# EAGLE design megajoltC (EAGLE 5.09)

## Sheet 1 of 5
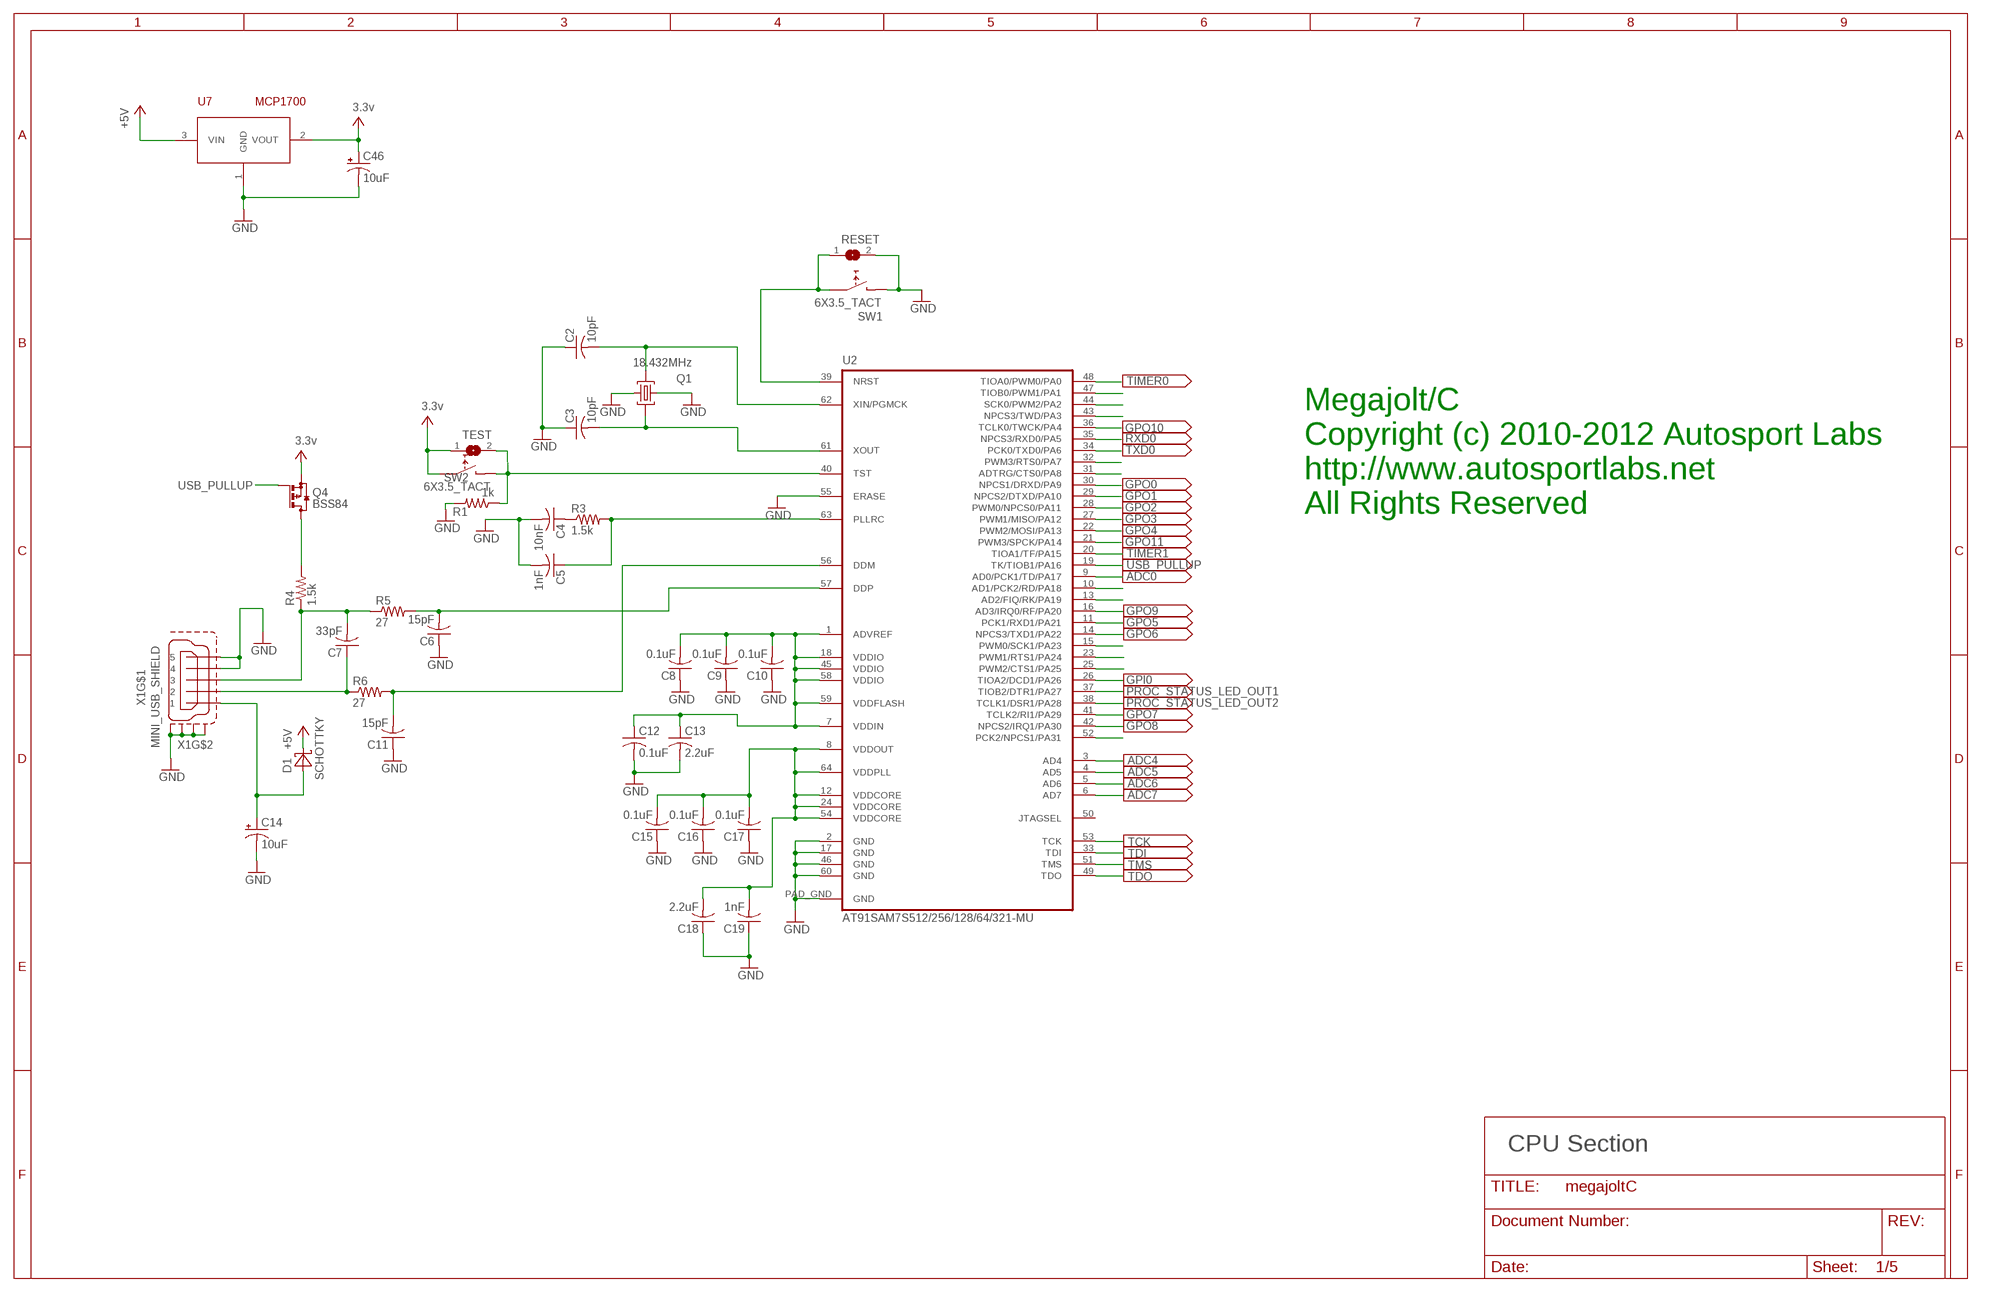
[diagram p0: schematic, sheet 1]

### Parts
C2  10pF  C-USC0603  [C0603]
C3  10pF  C-USC0603  [C0603]
C4  10nF  C-USC0603  [C0603]
C5  1nF  C-USC0603  [C0603]
C6  15pF  C-USC0603  [C0603]
C7  33pF  C-USC0603  [C0603]
C8  0.1uF  C-USC0603  [C0603]
C9  0.1uF  C-USC0603  [C0603]
C10  0.1uF  C-USC0603  [C0603]
C11  15pF  C-USC0603  [C0603]
C12  0.1uF  C-USC0603  [C0603]
C13  2.2uF  C-USC0603  [C0603]
C14  10uF  CPOL-USSMCA  [SMC_A]
C15  0.1uF  C-USC0603  [C0603]
C16  0.1uF  C-USC0603  [C0603]
C17  0.1uF  C-USC0603  [C0603]
C18  2.2uF  C-USC0603  [C0603]
C19  1nF  C-USC0603  [C0603]
C46  10uF  CPOL-USSMCA  [SMC_A]
D1  SCHOTTKY  [SMA]
Q1  18.432MHz  ABM8X2  [5X3.2]
Q4  BSS84  [SOT23]
R1  1k  R-US_R0603  [R0603]
R3  1.5k  R-US_R0603  [R0603]
R4  1.5k  R-US_R0603  [R0603]
R5  27  R-US_R0603  [R0603]
R6  27  R-US_R0603  [R0603]
RESET  SJ  [SJ]
SW1  6X3.5_TACT  [TACT_6X3.5]
SW2  6X3.5_TACT  [TACT_6X3.5]
TEST  SJ  [SJ]
U2  AT91SAM7S512/256/128/64/321-MU  [QFN64]
U7  MCP1700  [SOT-23]
X1  MINI_USB_SHIELD  [MINI-USB_JACK]

### Nets
+5V: D1.C U7.3(VIN) ; also sheet 2,3,4,5
ADC0: U2.9(AD0/PCK1/TD/PA17) ; also sheet 2
ADC4: U2.3(AD4) ; also sheet 2
ADC5: U2.4(AD5) ; also sheet 2
ADC6: U2.5(AD6) ; also sheet 2
ADC7: U2.6(AD7) ; also sheet 2
DDM: C11.2 R6.2 U2.56(DDM)
DDP: C6.2 R5.2 U2.57(DDP)
GND: C2.1 C3.1 C4.2 C5.2 C6.1 C8.1 C9.1 C10.1 C11.1 C12.2 C13.2 C14.- C15.1 C16.1 C17.1 C18.1 C19.1 C46.- Q1.2(CRYSTAL1) Q1.4(CRYSTAL2) R1.2 RESET.2 SW1.P$2 U2.2(GND) U2.17(GND) U2.46(GND) U2.55(ERASE) U2.60(GND) U2.PAD_GND(GND) U7.1(GND) X1.4 X1.5 X1.M1(S1) X1.M2(S2) X1.M3(S3) X1.M4(S4) ; also sheet 2,3,4,5
GPI0: U2.26(TIOA2/DCD1/PA26) ; also sheet 2
GPO0: U2.30(NPCS1/DRXD/PA9) ; also sheet 5
GPO1: U2.29(NPCS2/DTXD/PA10) ; also sheet 5
GPO2: U2.28(PWM0/NPCS0/PA11) ; also sheet 5
GPO3: U2.27(PWM1/MISO/PA12) ; also sheet 5
GPO4: U2.22(PWM2/MOSI/PA13) ; also sheet 5
GPO5: U2.11(PCK1/RXD1/PA21) ; also sheet 5
GPO6: U2.14(NPCS3/TXD1/PA22) ; also sheet 5
GPO7: U2.41(TCLK2/RI1/PA29) ; also sheet 5
GPO8: U2.42(NPCS2/IRQ1/PA30) ; also sheet 2
GPO9: U2.16(AD3/IRQ0/RF/PA20) ; also sheet 2
GPO10: U2.36(TCLK0/TWCK/PA4) ; also sheet 5
GPO11: U2.21(PWM3/SPCK/PA14) ; also sheet 2
N$1: R1.1 SW2.P$2 TEST.2 U2.40(TST)
N$3: C7.2 R4.1 R5.1 X1.3
N$4: C7.1 R6.1 X1.2
N$17: U2.47(TIOB0/PWM1/PA1)
N$18: Q4.3(D) R4.2
N$20: U2.44(SCK0/PWM2/PA2)
N$23: U2.43(NPCS3/TWD/PA3)
N$24: U2.32(PWM3/RTS0/PA7)
N$25: U2.31(ADTRG/CTS0/PA8)
N$34: U2.23(PWM1/RTS1/PA24)
N$35: U2.10(AD1/PCK2/RD/PA18)
N$36: U2.13(AD2/FIQ/RK/PA19)
N$37: U2.15(PWM0/SCK1/PA23)
N$38: U2.25(PWM2/CTS1/PA25)
N$39: U2.52(PCK2/NPCS1/PA31)
N$40: C4.1 R3.1
PLLRC: C5.1 R3.2 U2.63(PLLRC)
PROC_STATUS_LED_OUT1: U2.37(TIOB2/DTR1/PA27) ; also sheet 2
PROC_STATUS_LED_OUT2: U2.38(TCLK1/DSR1/PA28) ; also sheet 2
RESET: RESET.1 SW1.P$1 U2.39(NRST) ; also sheet 3
RXD0: U2.35(NPCS3/RXD0/PA5) ; also sheet 3
TCK: U2.53(TCK) ; also sheet 3
TDI: U2.33(TDI) ; also sheet 3
TDO: U2.49(TDO) ; also sheet 3
TIMER0: U2.48(TIOA0/PWM0/PA0) ; also sheet 4
TIMER1: U2.20(TIOA1/TF/PA15) ; also sheet 4
TMS: U2.51(TMS) ; also sheet 3
TXD0: U2.34(PCK0/TXD0/PA6) ; also sheet 3
USB_PULLUP: Q4.1(G) U2.19(TK/TIOB1/PA16)
V+: C8.2 C9.2 C10.2 C12.1 C13.1 C46.+ Q4.2(S) SW2.P$1 TEST.1 U2.1(ADVREF) U2.7(VDDIN) U2.18(VDDIO) U2.45(VDDIO) U2.58(VDDIO) U2.59(VDDFLASH) U7.2(VOUT) ; supply symbol labelled 3.3v ; also sheet 3
VBUS: C14.+ D1.A X1.1
VDDOUT: C15.2 C16.2 C17.2 C18.2 C19.2 U2.8(VDDOUT) U2.12(VDDCORE) U2.24(VDDCORE) U2.54(VDDCORE) U2.64(VDDPLL)
XIN1: C3.2 Q1.1(GND1) U2.61(XOUT)
XOUT1: C2.2 Q1.3(GND2) U2.62(XIN/PGMCK)
Unconnected: U2.50(JTAGSEL)

### Notes on the sheet
- Megajolt/C
- Copyright (c) 2010-2012 Autosport Labs
- http://www.autosportlabs.net
- All Rights Reserved
- CPU Section

## Sheet 2 of 5
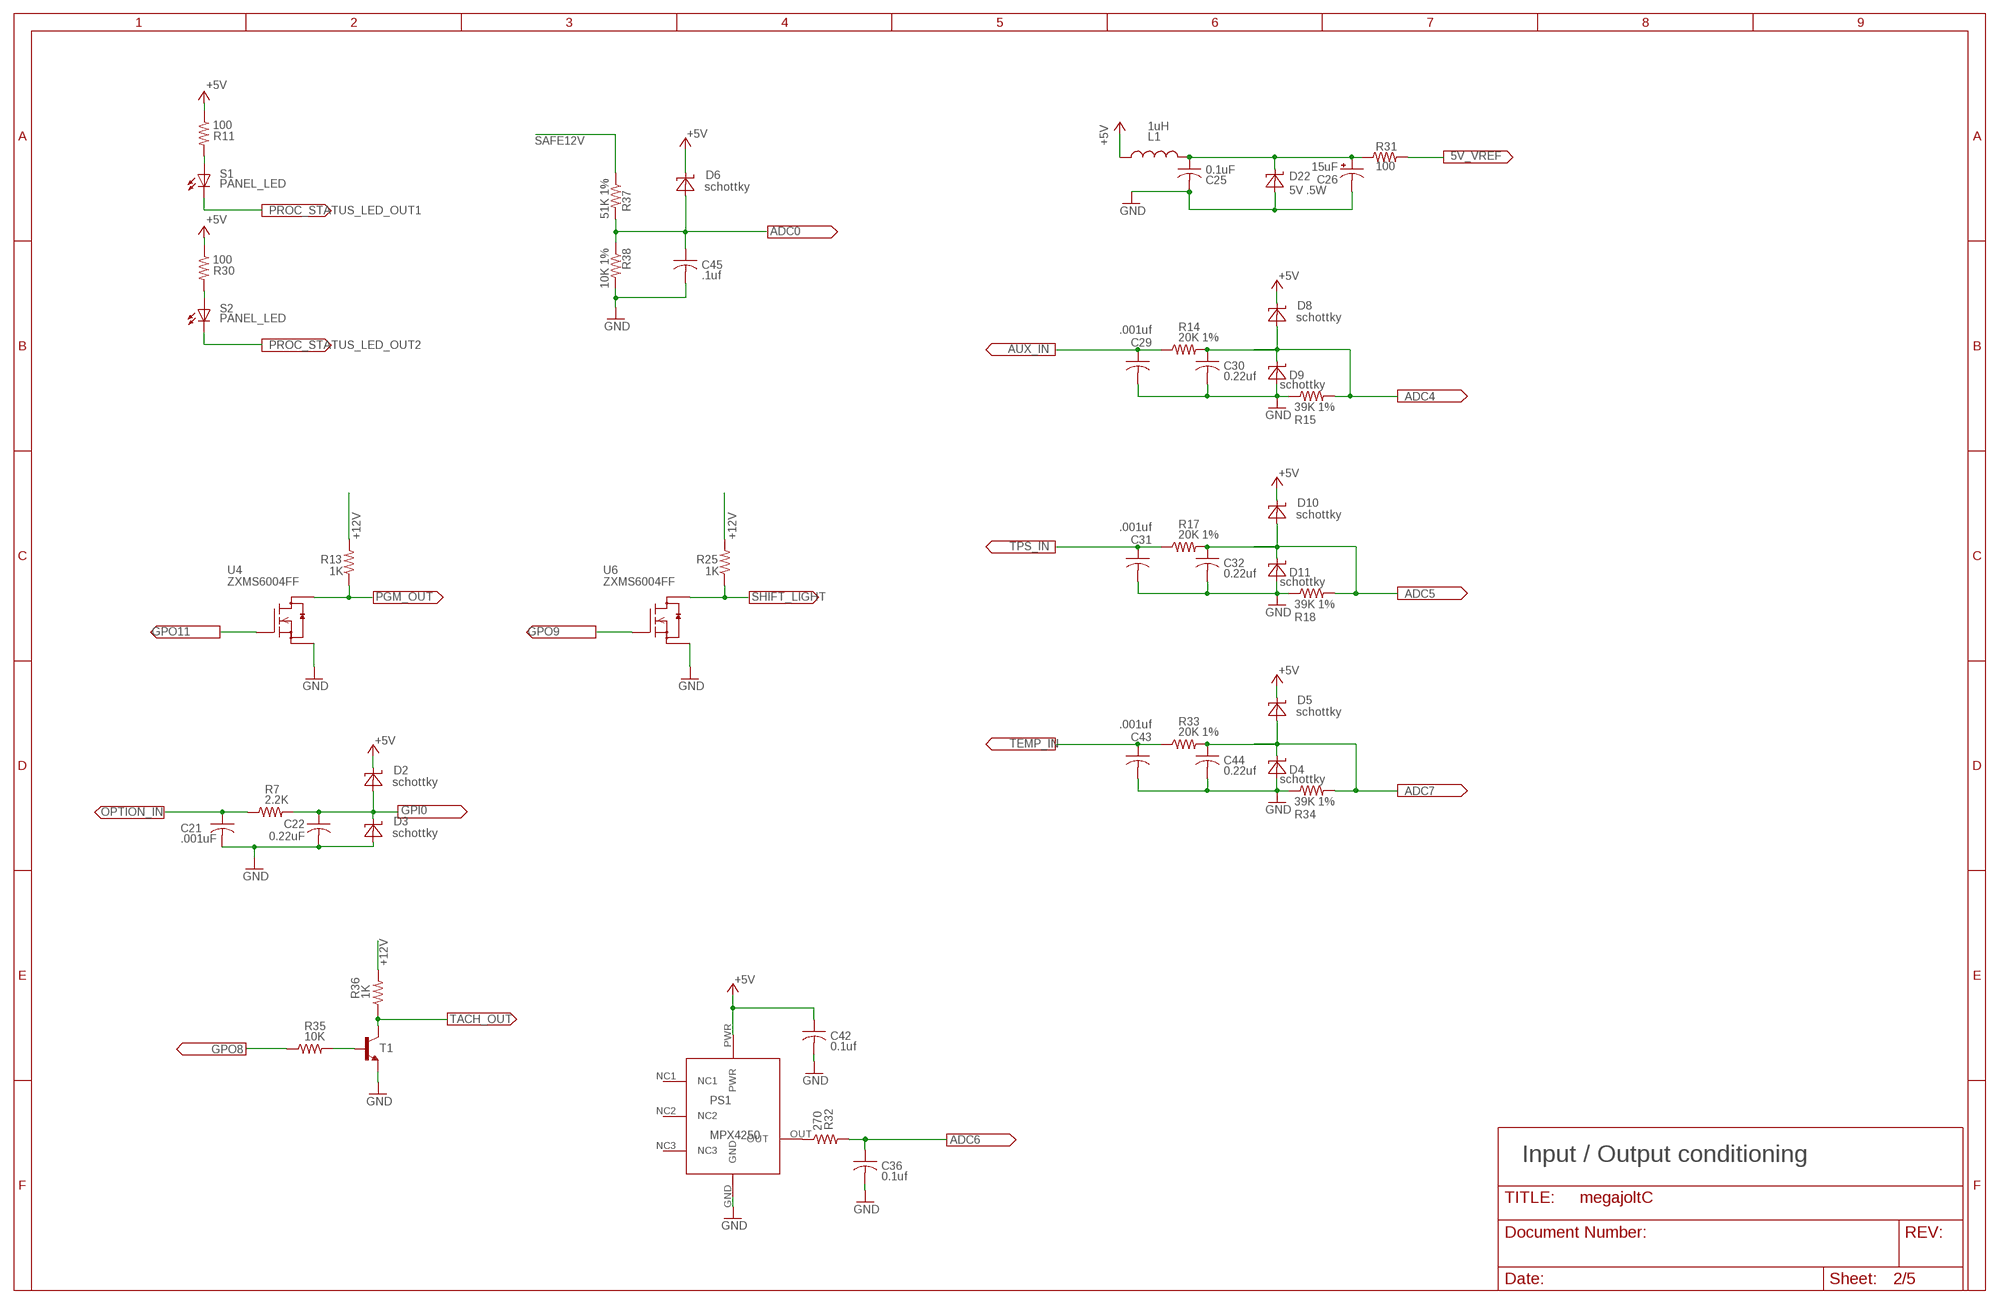
[diagram p1: schematic, sheet 2]

### Parts
C21  .001uF  C-USC0603  [C0603]
C22  0.22uF  C-USC0603  [C0603]
C25  0.1uF  C-USC0603  [C0603]
C26  15uF  CPOL-USSMCA  [SMC_A]
C29  .001uf  C-USC0603  [C0603]
C30  0.22uf  C-USC0603  [C0603]
C31  .001uf  C-USC0603  [C0603]
C32  0.22uf  C-USC0603  [C0603]
C36  0.1uf  C-USC0603  [C0603]
C42  0.1uf  C-USC0603  [C0603]
C43  .001uf  C-USC0603  [C0603]
C44  0.22uf  C-USC0603  [C0603]
C45  .1uf  C-USC0603  [C0603]
D2  schottky  ZENER2  [SOD123]
D3  schottky  ZENER2  [SOD123]
D4  schottky  ZENER2  [SOD123]
D5  schottky  ZENER2  [SOD123]
D6  schottky  ZENER2  [SOD123]
D8  schottky  ZENER2  [SOD123]
D9  schottky  ZENER2  [SOD123]
D10  schottky  ZENER2  [SOD123]
D11  schottky  ZENER2  [SOD123]
D22  5V .5W  ZENER2  [SOD123]
L1  1uH  INDUCTOR  [1210]
PS1  MPX4250  [MPX4250]
R7  2.2K  R-US_R0603  [R0603]
R11  100  R-US_R0603  [R0603]
R13  1K  R-US_R0603  [R0603]
R14  20K 1%  R-US_R0603  [R0603]
R15  39K 1%  R-US_R0603  [R0603]
R17  20K 1%  R-US_R0603  [R0603]
R18  39K 1%  R-US_R0603  [R0603]
R25  1K  R-US_R0603  [R0603]
R30  100  R-US_R0603  [R0603]
R31  100  R-US_R1206  [R1206]
R32  270  R-US_R0603  [R0603]
R33  20K 1%  R-US_R0603  [R0603]
R34  39K 1%  R-US_R0603  [R0603]
R35  10K  R-US_R0603  [R0603]
R36  1K  R-US_R0603  [R0603]
R37  51K 1%  R-US_R0603  [R0603]
R38  10K 1%  R-US_R0603  [R0603]
S1  PANEL_LED  [RIGHTANGLE_CML_5323F5]
S2  PANEL_LED  [RIGHTANGLE_CML_5323F5]
T1  -NPN-SOT23-EBC  [SOT23-EBC]
U4  ZXMS6004FF  [SOT-23]
U6  ZXMS6004FF  [SOT-23]

### Nets
5V_VREF: R31.2 ; also sheet 3
5V_VREF_PROTECTED: C25.1 C26.+ D22.C L1.2 R31.1
+5V: C42.1 D2.C D5.C D6.C D8.C D10.C L1.1 PS1.PWR R11.1 R30.1 ; also sheet 1,3,4,5
+12V: R13.2 R25.2 R36.2 ; also sheet 3
ADC0: C45.1 D6.A R37.2 R38.1 ; also sheet 1
ADC4: C30.1 D8.A D9.C R14.2 R15.2 ; also sheet 1
ADC5: C32.1 D10.A D11.C R17.2 R18.2 ; also sheet 1
ADC6: C36.1 R32.2 ; also sheet 1
ADC7: C44.1 D4.C D5.A R33.2 R34.2 ; also sheet 1
AUX_IN: C29.1 R14.1 ; also sheet 3
GND: C21.2 C22.2 C25.2 C26.- C29.2 C30.2 C31.2 C32.2 C36.2 C42.2 C43.2 C44.2 C45.2 D3.A D4.A D9.A D11.A D22.A PS1.GND R15.1 R18.1 R34.1 R38.2 T1.E U4.2(S1) U6.2(S1) ; also sheet 1,3,4,5
GPI0: D2.A D3.C ; also sheet 1
GPO8: R35.1 ; also sheet 1
GPO9: U6.1(G) ; also sheet 1
GPO11: U4.1(G) ; also sheet 1
N$7: PS1.OUT R32.1
N$16: R35.2 T1.B
N$19: R11.2 S1.A
N$21: R30.2 S2.A
OPTION_IN: C21.1 R7.1 ; also sheet 3
PGM_OUT: R13.1 U4.3(D1) ; also sheet 3
PROC_PULSE_IN: C22.1 R7.2
PROC_STATUS_LED_OUT1: S1.C ; also sheet 1
PROC_STATUS_LED_OUT2: S2.C ; also sheet 1
SAFE12V: R37.1 ; also sheet 3
SHIFT_LIGHT: R25.1 U6.3(D1) ; also sheet 3
TACH_OUT: R36.1 T1.C ; also sheet 3
TEMP_IN: C43.1 R33.1 ; also sheet 3
TPS_IN: C31.1 R17.1 ; also sheet 3

### Notes on the sheet
- Input / Output conditioning

## Sheet 3 of 5
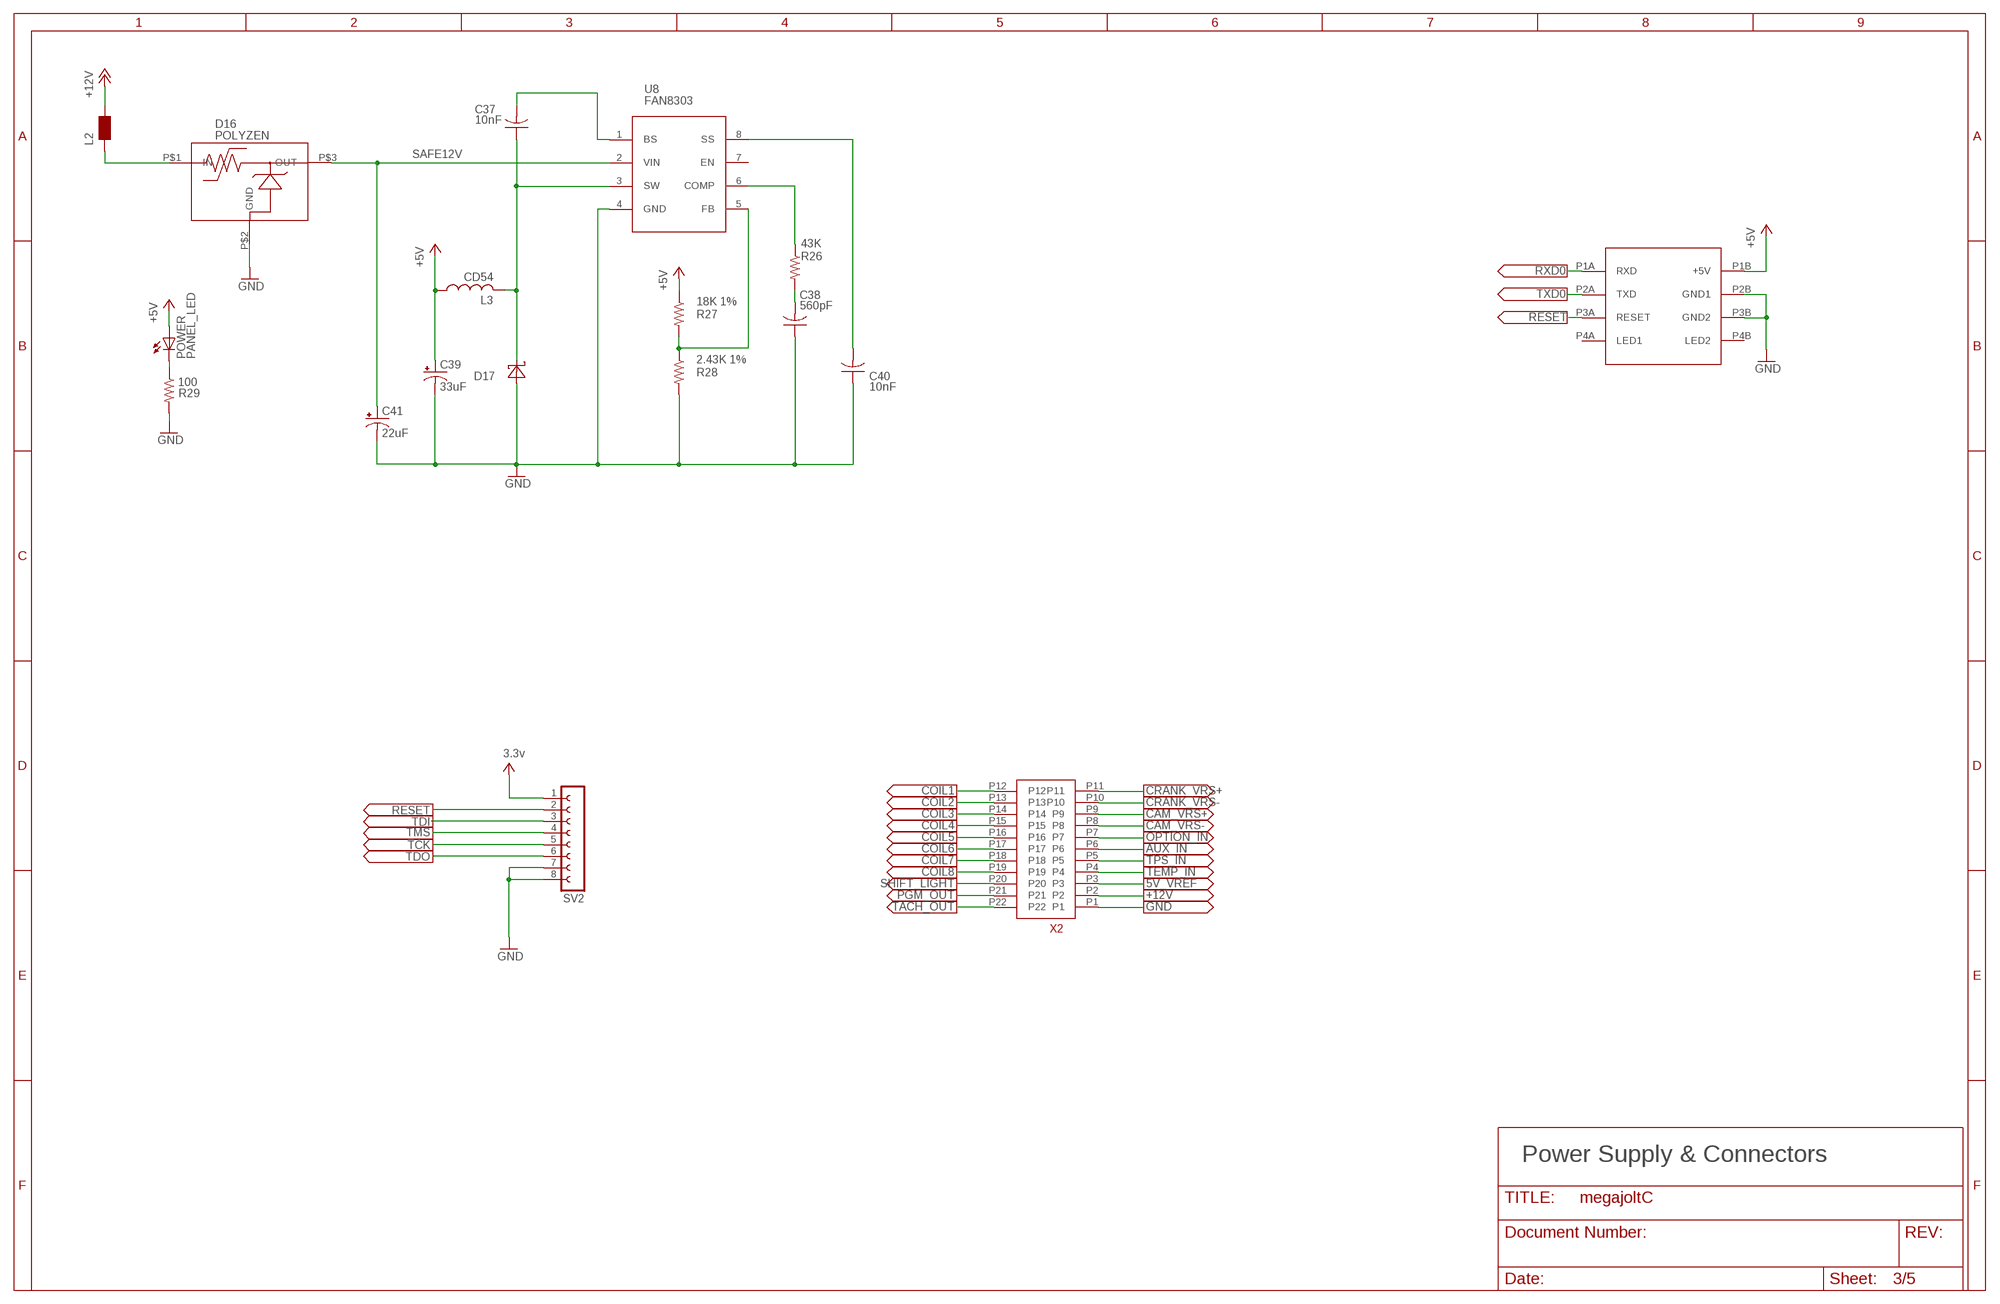
[diagram p2: schematic, sheet 3]

### Parts
BLUE_TUNE  ASL_BLUETOOTH_MODULE  [BLUETOOTH_MODULE]
C37  10nF  C-USC0603  [C0603]
C38  560pF  C-USC0603  [C0603]
C39  33uF  CPOL-USSMCD  [SMC_D]
C40  10nF  C-USC0603  [C0603]
C41  22uF  CPOL-US153CLV-0605  [153CLV-0605]
D16  POLYZEN  [POLYZEN]
D17  SCHOTTKY  [SMA]
L2  WE-CBF_1812  [1812]
L3  CD54  [CD54]
POWER  PANEL_LED  [RIGHTANGLE_CML_5323F5]
R26  43K  R-US_R0603  [R0603]
R27  18K 1%  R-US_R0603  [R0603]
R28  2.43K 1%  R-US_R0603  [R0603]
R29  100  R-US_R0603  [R0603]
SV2  FE08-1  [FE08]
U8  FAN8303  [SO-8]
X2  MOLEX_MINIFIT-22  [MOLEX_MINIFIT-22]

### Nets
5V_VREF: X2.P3 ; also sheet 2
+5V: BLUE_TUNE.P1B(+5V) C39.+ L3.P$1 POWER.A R27.1 ; also sheet 1,2,4,5
+12V: L2.2 X2.P2 ; also sheet 2
AUX_IN: X2.P6 ; also sheet 2
CAM_VRS+: X2.P9 ; also sheet 4
CAM_VRS-: X2.P8 ; also sheet 4
COIL1: X2.P12 ; also sheet 5
COIL2: X2.P13 ; also sheet 5
COIL3: X2.P14 ; also sheet 5
COIL4: X2.P15 ; also sheet 5
COIL5: X2.P16 ; also sheet 5
COIL6: X2.P17 ; also sheet 5
COIL7: X2.P18 ; also sheet 5
COIL8: X2.P19 ; also sheet 5
CRANK_VRS+: X2.P11 ; also sheet 4
CRANK_VRS-: X2.P10 ; also sheet 4
GND: BLUE_TUNE.P2B(GND1) BLUE_TUNE.P3B(GND2) C38.1 C39.- C40.1 C41.- D16.P$2(GND) D17.A R28.2 R29.2 SV2.7 SV2.8 U8.4(GND) X2.P1 ; also sheet 1,2,4,5
N$8: R27.2 R28.1 U8.5(FB)
N$9: C37.2 U8.1(BS)
N$10: C37.1 D17.C L3.P$2 U8.3(SW)
N$11: C38.2 R26.2
N$12: R26.1 U8.6(COMP)
N$13: C40.2 U8.8(SS)
N$15: D16.P$1(IN) L2.1
N$22: POWER.C R29.1
OPTION_IN: X2.P7 ; also sheet 2
PGM_OUT: X2.P21 ; also sheet 2
RESET: BLUE_TUNE.P3A(RESET) SV2.2 ; also sheet 1
RXD0: BLUE_TUNE.P1A(RXD) ; also sheet 1
SAFE12V: C41.+ D16.P$3(OUT) U8.2(VIN) ; also sheet 2
SHIFT_LIGHT: X2.P20 ; also sheet 2
TACH_OUT: X2.P22 ; also sheet 2
TCK: SV2.5 ; also sheet 1
TDI: SV2.3 ; also sheet 1
TDO: SV2.6 ; also sheet 1
TEMP_IN: X2.P4 ; also sheet 2
TMS: SV2.4 ; also sheet 1
TPS_IN: X2.P5 ; also sheet 2
TXD0: BLUE_TUNE.P2A(TXD) ; also sheet 1
V+: SV2.1 ; supply symbol labelled 3.3v ; also sheet 1
Unconnected: BLUE_TUNE.P4A(LED1) BLUE_TUNE.P4B(LED2) U8.7(EN)

### Notes on the sheet
- Power Supply & Connectors

## Sheet 4 of 5
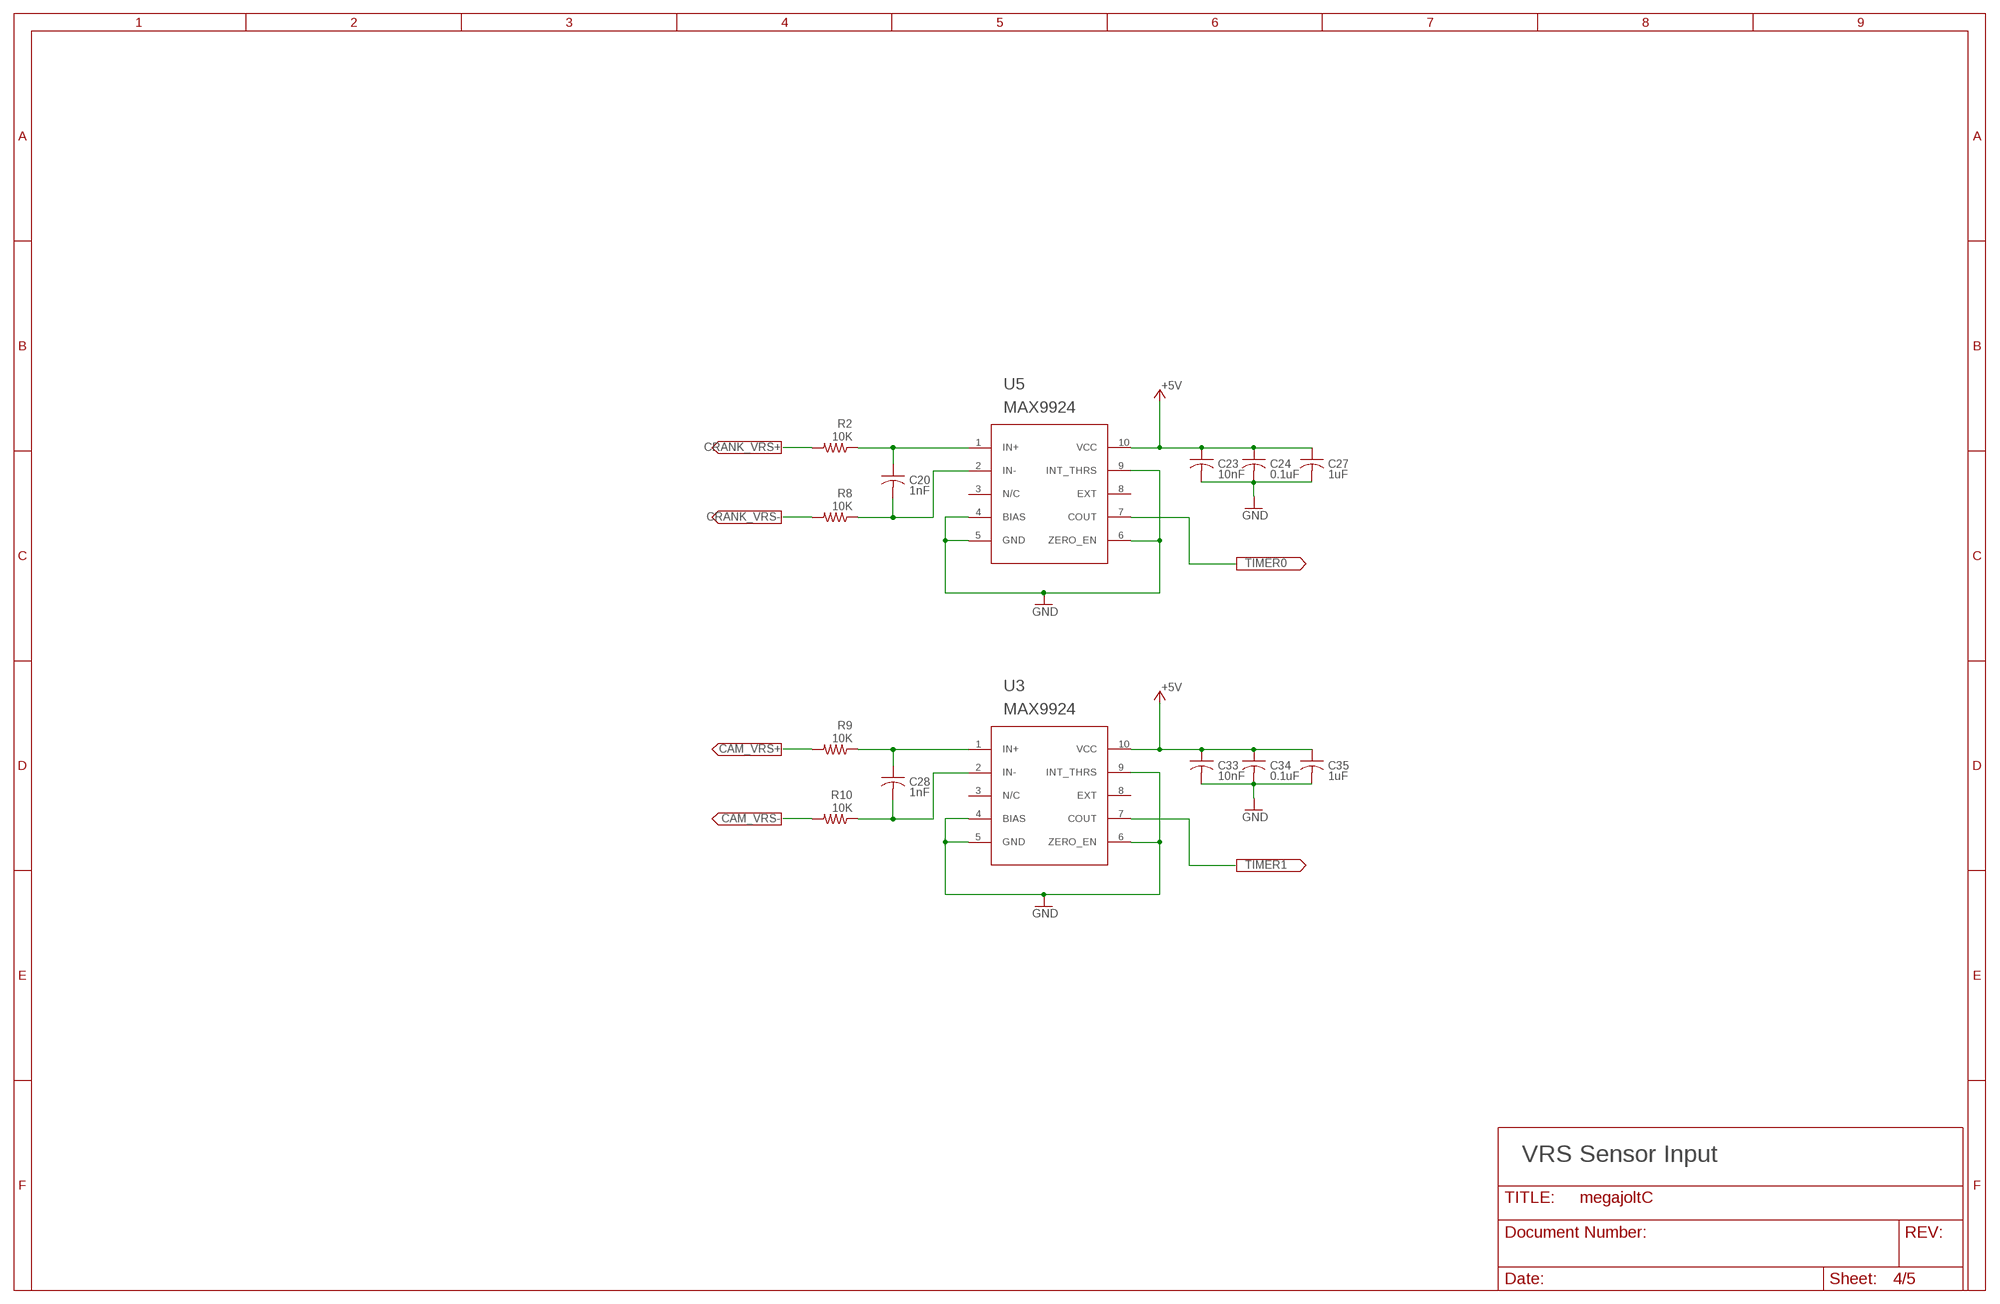
[diagram p3: schematic, sheet 4]

### Parts
C20  1nF  C-USC0603  [C0603]
C23  10nF  C-USC0603  [C0603]
C24  0.1uF  C-USC0603  [C0603]
C27  1uF  C-USC0603  [C0603]
C28  1nF  C-USC0603  [C0603]
C33  10nF  C-USC0603  [C0603]
C34  0.1uF  C-USC0603  [C0603]
C35  1uF  C-USC0603  [C0603]
R2  10K  R-US_R0603  [R0603]
R8  10K  R-US_R0603  [R0603]
R9  10K  R-US_R0603  [R0603]
R10  10K  R-US_R0603  [R0603]
U3  MAX9924  [UMAX10]
U5  MAX9924  [UMAX10]

### Nets
+5V: C23.1 C24.1 C27.1 C33.1 C34.1 C35.1 U3.10(VCC) U5.10(VCC) ; also sheet 1,2,3,5
CAM_VRS+: R9.2 ; also sheet 3
CAM_VRS-: R10.2 ; also sheet 3
CRANK_VRS+: R2.2 ; also sheet 3
CRANK_VRS-: R8.2 ; also sheet 3
GND: C23.2 C24.2 C27.2 C33.2 C34.2 C35.2 U3.4(BIAS) U3.5(GND) U3.6(ZERO_EN) U3.9(INT_THRS) U5.4(BIAS) U5.5(GND) U5.6(ZERO_EN) U5.9(INT_THRS) ; also sheet 1,2,3,5
N$2: C20.1 R2.1 U5.1(IN+)
N$5: C28.1 R9.1 U3.1(IN+)
N$6: C28.2 R10.1 U3.2(IN-)
N$14: C20.2 R8.1 U5.2(IN-)
TIMER0: U5.7(COUT) ; also sheet 1
TIMER1: U3.7(COUT) ; also sheet 1
Unconnected: U3.3(N/C) U3.8(EXT) U5.3(N/C) U5.8(EXT)

### Notes on the sheet
- VRS Sensor Input

## Sheet 5 of 5
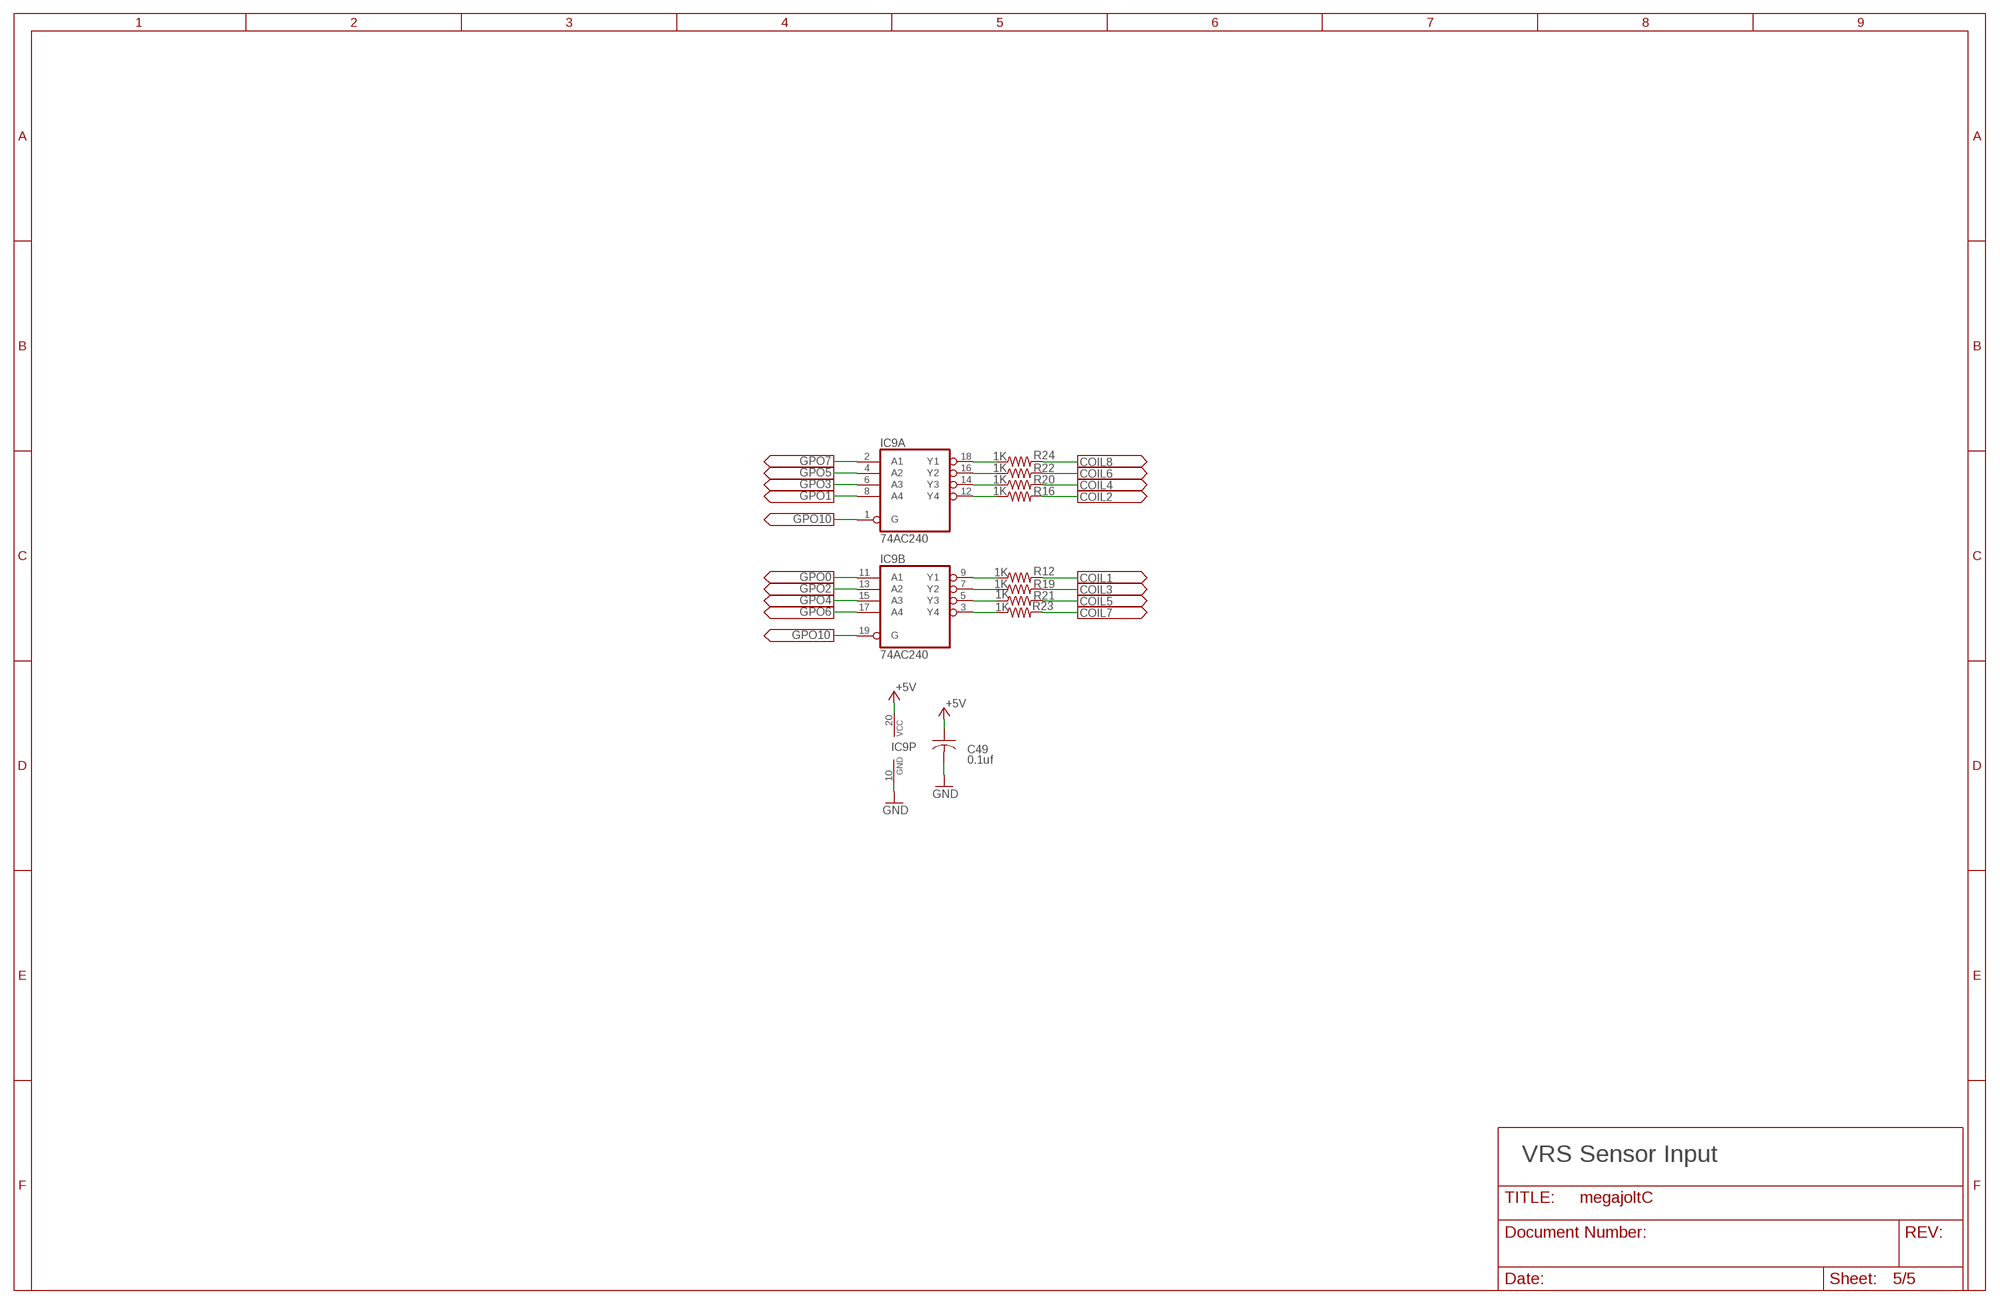
[diagram p4: schematic, sheet 5]

### Parts
C49  0.1uf  C-USC0603  [C0603]
IC9  74AC240  74S240DW  [SO20W]
R12  1K  R-US_R0603  [R0603]
R16  1K  R-US_R0603  [R0603]
R19  1K  R-US_R0603  [R0603]
R20  1K  R-US_R0603  [R0603]
R21  1K  R-US_R0603  [R0603]
R22  1K  R-US_R0603  [R0603]
R23  1K  R-US_R0603  [R0603]
R24  1K  R-US_R0603  [R0603]

### Nets
+5V: C49.1 IC9.20(P:VCC) ; also sheet 1,2,3,4
COIL1: R12.2 ; also sheet 3
COIL2: R16.2 ; also sheet 3
COIL3: R19.2 ; also sheet 3
COIL4: R20.2 ; also sheet 3
COIL5: R21.2 ; also sheet 3
COIL6: R22.2 ; also sheet 3
COIL7: R23.2 ; also sheet 3
COIL8: R24.2 ; also sheet 3
GND: C49.2 IC9.10(P:GND) ; also sheet 1,2,3,4
GPO0: IC9.11(B:A1) ; also sheet 1
GPO1: IC9.8(A:A4) ; also sheet 1
GPO2: IC9.13(B:A2) ; also sheet 1
GPO3: IC9.6(A:A3) ; also sheet 1
GPO4: IC9.15(B:A3) ; also sheet 1
GPO5: IC9.4(A:A2) ; also sheet 1
GPO6: IC9.17(B:A4) ; also sheet 1
GPO7: IC9.2(A:A1) ; also sheet 1
GPO10: IC9.1(A:G) IC9.19(B:G) ; also sheet 1
N$26: IC9.9(B:Y1) R12.1
N$27: IC9.12(A:Y4) R16.1
N$28: IC9.7(B:Y2) R19.1
N$29: IC9.14(A:Y3) R20.1
N$30: IC9.5(B:Y3) R21.1
N$31: IC9.16(A:Y2) R22.1
N$32: IC9.3(B:Y4) R23.1
N$33: IC9.18(A:Y1) R24.1

### Notes on the sheet
- VRS Sensor Input

## Power pins joined to a net without a drawn wire
NC1: PS1.NC1
NC2: PS1.NC2
NC3: PS1.NC3

## Library data of the parts
BLUE_TUNE = asl_bluetooth_module:ASL_BLUETOOTH_MODULE
C2-C13 C15-C25 C27-C38 C40 C42-C45 C49 = rcl:C-US: CAPACITOR, American symbol
C14 C26 C39 C41 C46 = rcl:CPOL-US: POLARIZED CAPACITOR, American symbol
D1 D17 = smt_diodes:SCHOTTKY
D2-D6 D8-D11 D22 = smt_diodes:ZENER
D16 = polyzen:POLYZEN
IC9 = 74xx-eu:74*240: Octal BUFFER and LINE DRIVER, 3-state
L1 = smt_inductors:INDUCTOR
L2 = wuerth-elektronik:WE-CBF: SMD EMI Suppression Ferrite Beads - excellent anti-EMI properties - low DCR - impedances till 3000 ohms - rated current up to 6 A
L3 = sumida_inductors:CD54
POWER S1 S2 = LEDs:PANEL_LED
PS1 = pressure_sensor:MPX4250
Q1 = crystal_smd:ABM8X
Q4 = transistor-small-signal:BSS84: P-CHANNEL MOS FET
R1-R38 = rcl:R-US_: RESISTOR, American symbol
RESET TEST = jumper:SJ: SMD solder JUMPER
SV2 = con-lsta:FE08-1: FEMALE HEADER; OC_FARNELL: unknown; OC_NEWARK: unknown
SW1 SW2 = tactile_switch:6X3.5_TACT
T1 = transistor:*-NPN-: NPN Transistror BF959 corrected 2008.03.06
U2 = atmel-arm:AT91SAM7S512/256/128/64/321: AT91SAM7S512/256/128/64/321 ARM7 Processor
U3 U5 = max9924_9927:MAX9924
U4 U6 = power_mosfets:ZXMS6004FF
U7 = mcp1700:MCP1700
U8 = voltage_regulators:FAN8303
X1 = cnkls_parts:MINI_USB_SHIELD
X2 = molex_mini-fit:MOLEX_MINIFIT-22

## Board
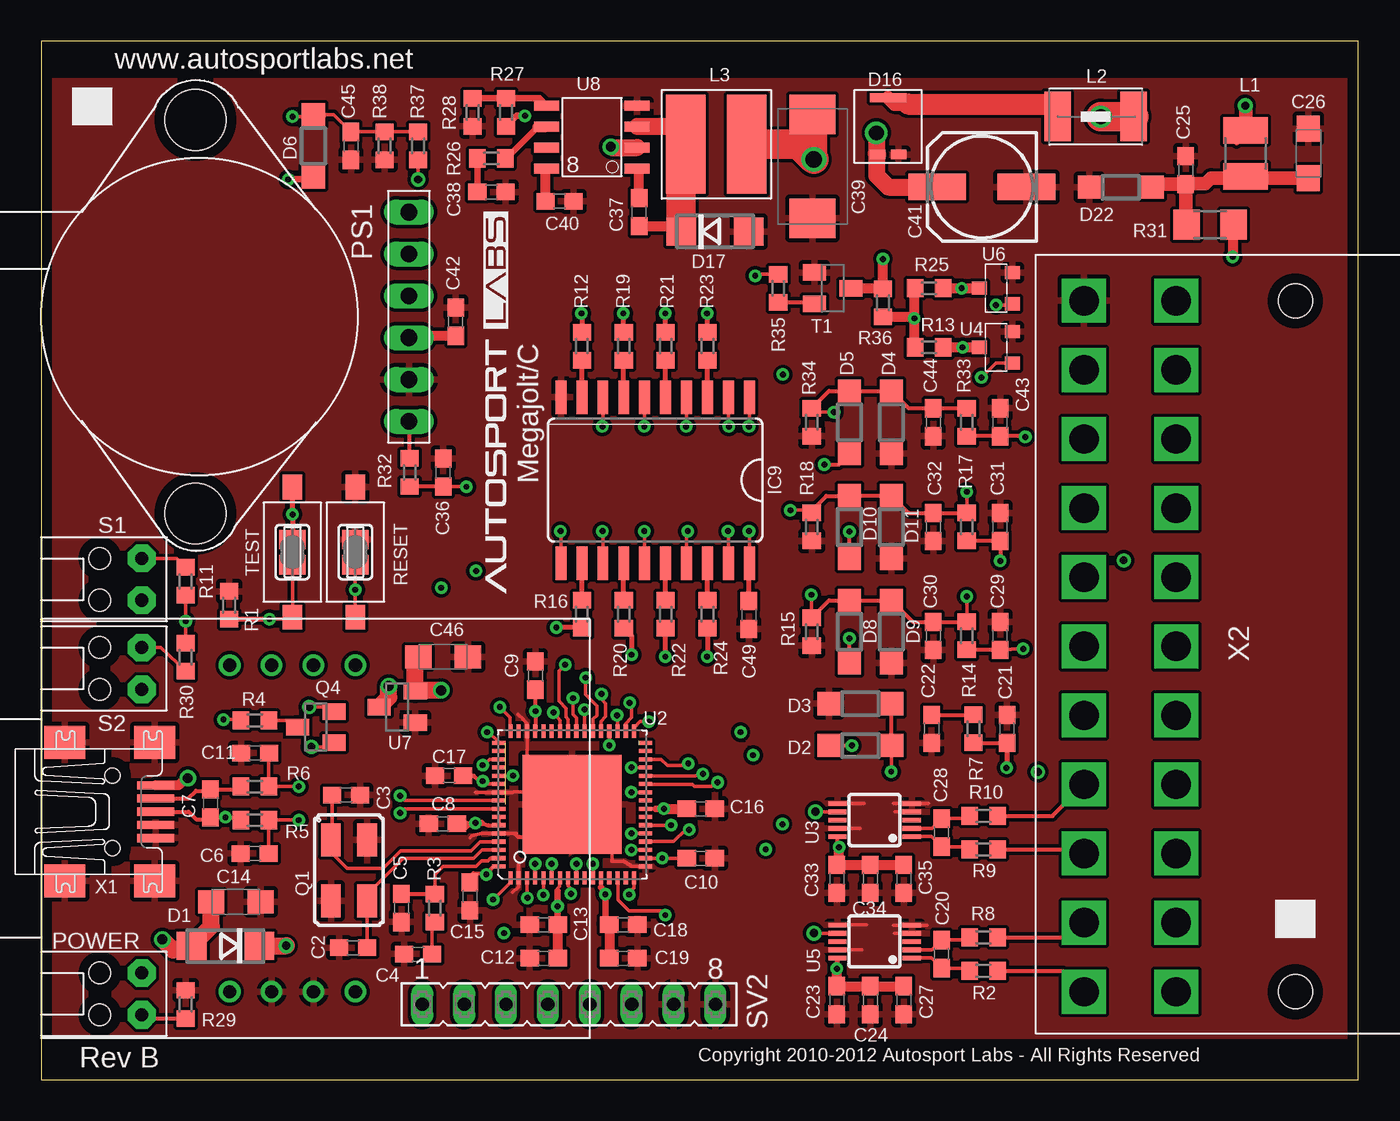
[diagram p5: board, top side]
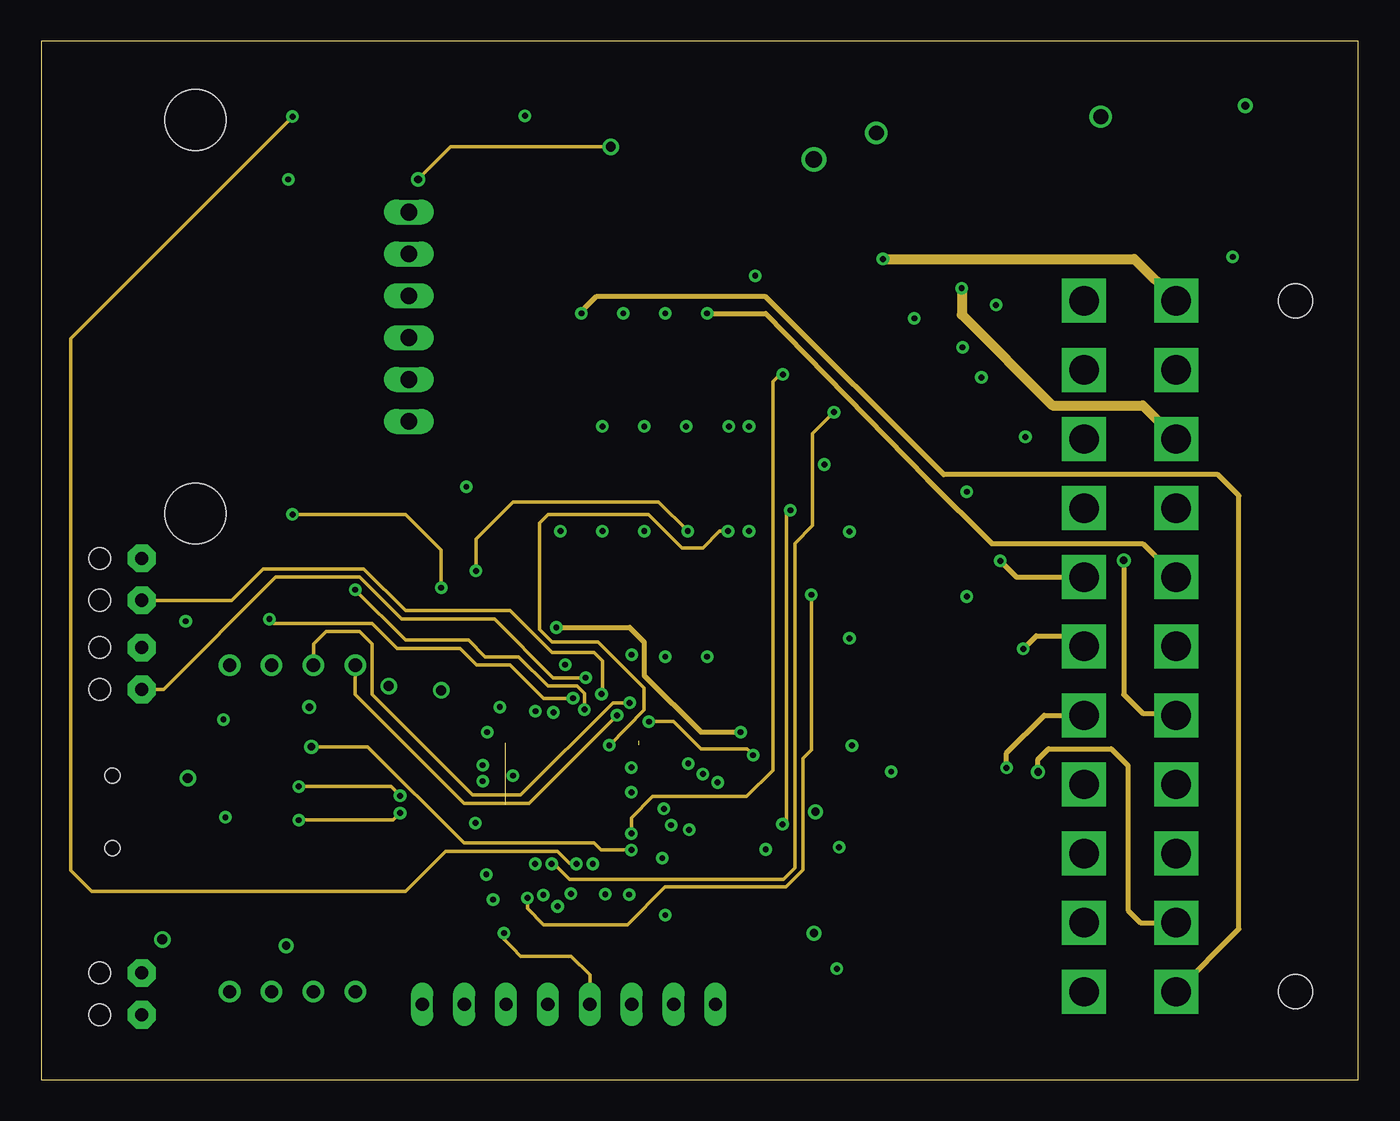
[diagram p6: board, inner layer Route2]
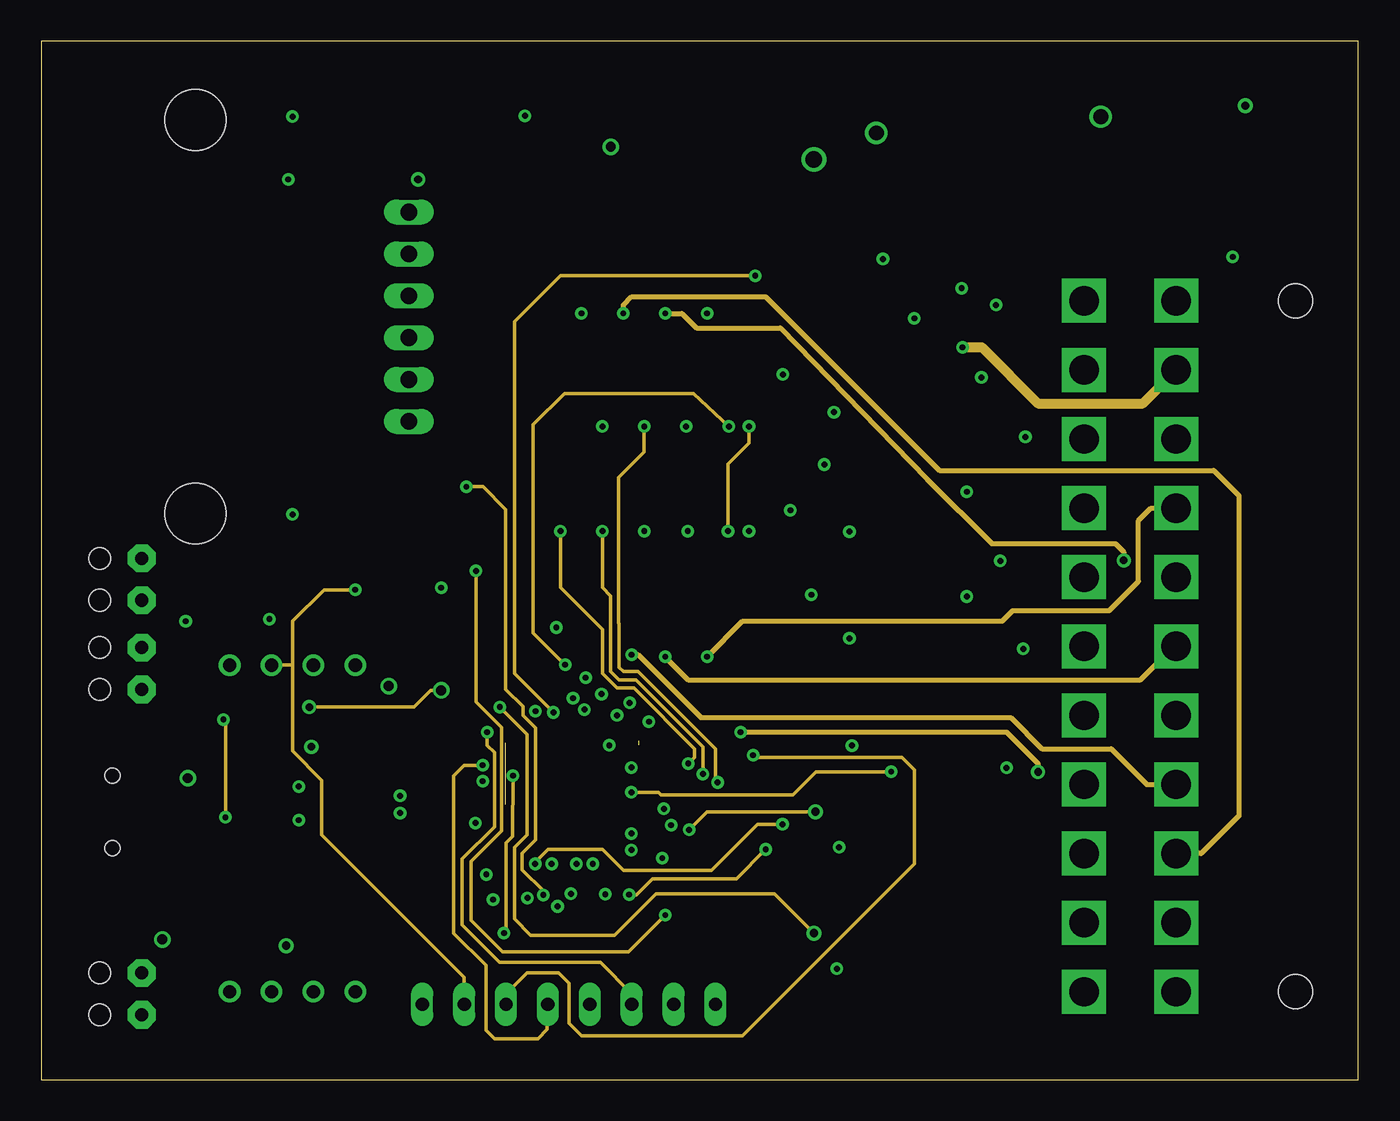
[diagram p7: board, inner layer Route15]
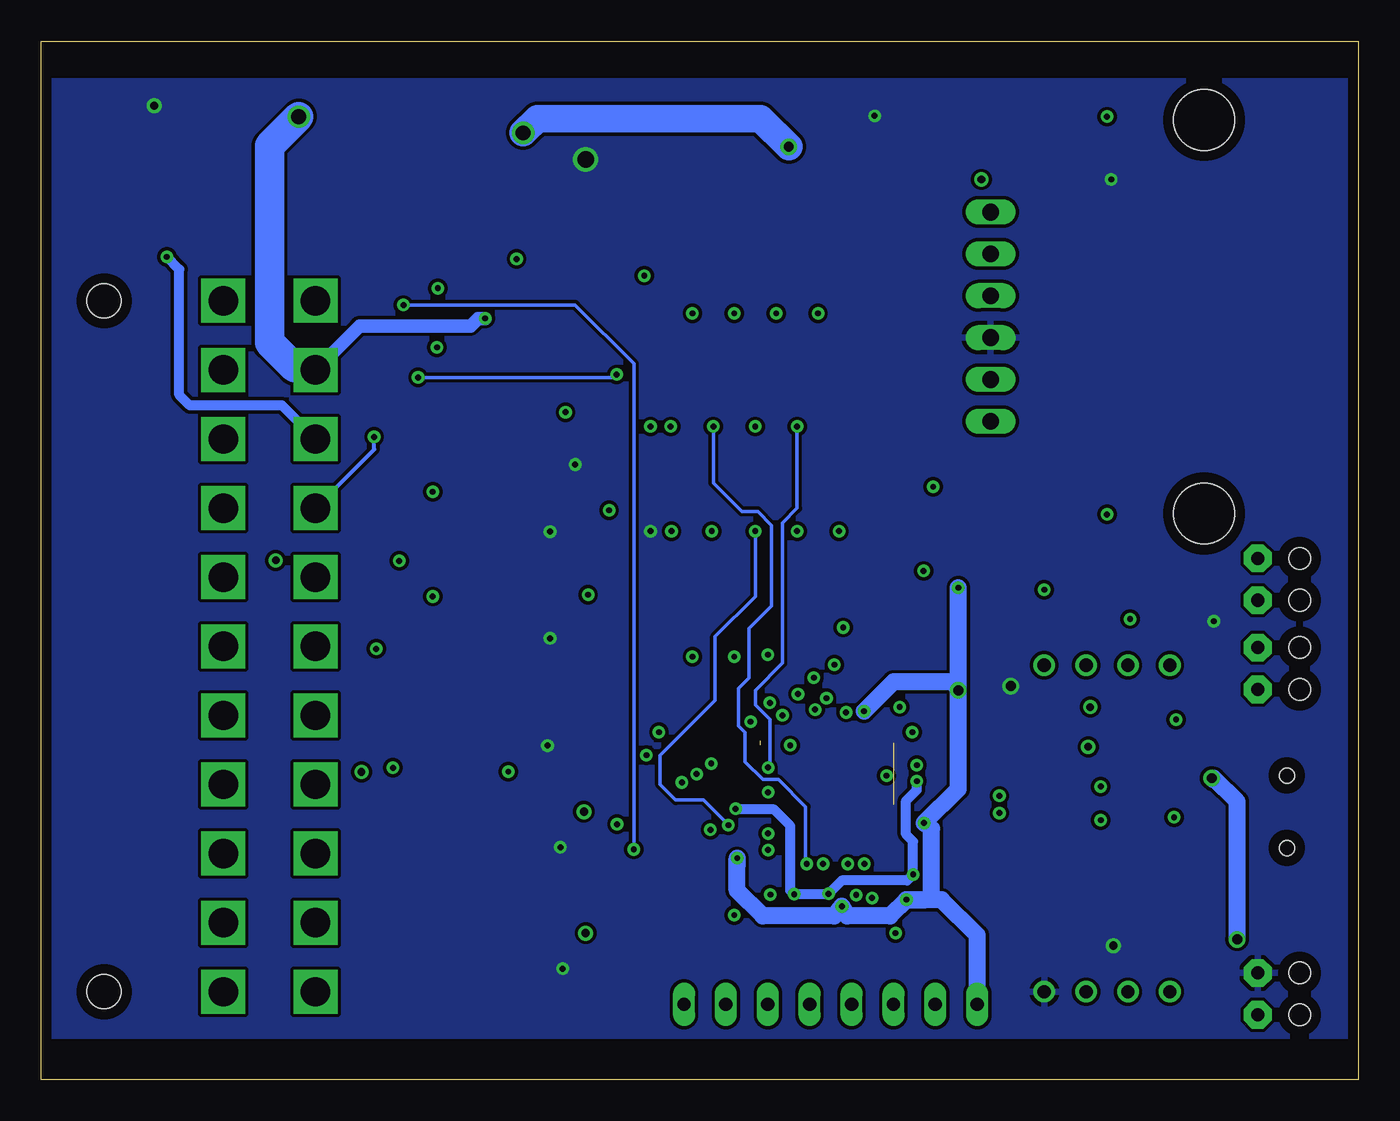
[diagram p8: board, bottom side, seen from below]

Size 79.88 x 62.99 mm. Coordinates in mm from the lower left corner, seen from the top.
Outline: 0,0 79.88,0 79.88,62.99 0,62.99 0,0
Copper layers (1+2*15+16): Top 0.035mm / dielectric 1.5mm / Route2 0.035mm / dielectric 1.5mm / Route15 0.035mm / dielectric 1.5mm / Bottom 0.035mm
Design rules "default *": minimum track width 8mil, minimum drill 14mil, track to track 8mil, track to pad 8mil, pad to pad 8mil, via to via 8mil, smd to smd 8mil, copper to edge 25mil, drill to drill 8mil, minimum pad ring 10mil, minimum via ring 8mil, stop-mask expansion 4mil, vias tented up to drill 19mil, thermal gap 10mil

### Footprints (pad centres in the part's own frame; a part is rotated, then mirrored left to right if it is on the bottom)
BLUETOOTH_MODULE = drill 0.8 round: P1A 2.794,19.05; P1B 22.606,19.05; P2A 2.794,16.51; P2B 22.606,16.51; P3A 2.794,13.97; P3B 22.606,13.97; P4A 2.794,11.43; P4B 22.606,11.43
C0603 = smd 1.1 x 1: 1 -0.85,0; 2 0.85,0
SMC_A = smd 1.6 x 1.4: + -1.5,0; - 1.5,0
SMC_D = smd 2.4 x 2.8: + -3.15,0; - 3.15,0
153CLV-0605 = smd 3.5 x 1.6: + 2.7,0; - -2.7,0
SMA = smd 1.8 x 1.7: A 2.05,0; C -2.05,0
SOD123 = smd 1.4 x 1.4: A 1.9,0; C -1.9,0
POLYZEN = smd 0.559 x 2.21: P$1 0.356,0 | smd 0.559 x 0.94: P$2 3.797,0.635; P$3 3.797,-0.635
SO20W = smd 0.66 x 2.032: 1 -5.715,-5.029; 2 -4.445,-5.029; 3 -3.175,-5.029; 4 -1.905,-5.029; 5 -0.635,-5.029; 6 0.635,-5.029; 7 1.905,-5.029; 8 3.175,-5.029; 9 4.445,-5.029; 10 5.715,-5.029; 11 5.715,5.029; 12 4.445,5.029; 13 3.175,5.029; 14 1.905,5.029; 15 0.635,5.029; 16 -0.635,5.029; 17 -1.905,5.029; 18 -3.175,5.029; 19 -4.445,5.029; 20 -5.715,5.029
1210 = smd 1.6 x 2.7: 1 -1.4,0; 2 1.4,0
1812 = smd 1.6 x 3: 1 -2.3,0; 2 2.3,0
CD54 = smd 6 x 2.4: P$1 0,1.85; P$2 0,-1.85
RIGHTANGLE_CML_5323F5 = drill 0.8 pad 1.676 octagon: A -1.27,1.651; C 1.27,1.651 | hole 1.295: 1.27,-0.889; -1.27,-0.889
MPX4250 = drill 1.016 long: GND 3.81,0; NC1 -1.27,0; NC2 -3.81,0; NC3 -6.35,0; OUT 6.35,0; PWR 1.27,0 | hole 3.683: -11.938,-12.954; 11.938,-12.954
5X3.2 = smd 2 x 1.2: 1 -1.85,-1.1; 2 1.85,-1.1; 3 1.85,1.1; 4 -1.85,1.1
SOT23 = smd 1 x 1.4: 1 -0.95,-1.1; 2 0.95,-1.1; 3 0,1.1
R0603 = smd 1 x 1.1: 1 -0.85,0; 2 0.85,0
R1206 = smd 1.6 x 1.803: 1 -1.422,0; 2 1.422,0
SJ = smd 1.168 x 1.6: 1 -0.762,0; 2 0.762,0
FE08 = drill 0.813 long: 1 -8.89,0; 2 -6.35,0; 3 -3.81,0; 4 -1.27,0; 5 1.27,0; 6 3.81,0; 7 6.35,0; 8 8.89,0
TACT_6X3.5 = smd 1.5 x 1.2: P$1 -3.95,0; P$2 3.95,0
SOT23-EBC = smd 1 x 1.4: B 0.95,-1.1; C 0,1.1; E -0.95,-1.1
QFN64 = smd 0.8 x 0.25: 1 -4.45,3.75; 2 -4.45,3.25; 3 -4.45,2.75; 4 -4.45,2.25; 5 -4.45,1.75; 6 -4.45,1.25; 7 -4.45,0.75; 8 -4.45,0.25; 9 -4.45,-0.25; 10 -4.45,-0.75; 11 -4.45,-1.25; 12 -4.45,-1.75; 13 -4.45,-2.25; 14 -4.45,-2.75; 15 -4.45,-3.25; 16 -4.45,-3.75; 33 4.45,-3.75; 34 4.45,-3.25; 35 4.45,-2.75; 36 4.45,-2.25; 37 4.45,-1.75; 38 4.45,-1.25; 39 4.45,-0.75; 40 4.45,-0.25; 41 4.45,0.25; 42 4.45,0.75; 43 4.45,1.25; 44 4.45,1.75; 45 4.45,2.25; 46 4.45,2.75; 47 4.45,3.25; 48 4.45,3.75 | smd 0.25 x 0.8: 17 -3.75,-4.45; 18 -3.25,-4.45; 19 -2.75,-4.45; 20 -2.25,-4.45; 21 -1.75,-4.45; 22 -1.25,-4.45; 23 -0.75,-4.45; 24 -0.25,-4.45; 25 0.25,-4.45; 26 0.75,-4.45; 27 1.25,-4.45; 28 1.75,-4.45; 29 2.25,-4.45; 30 2.75,-4.45; 31 3.25,-4.45; 32 3.75,-4.45; 49 3.75,4.45; 50 3.25,4.45; 51 2.75,4.45; 52 2.25,4.45; 53 1.75,4.45; 54 1.25,4.45; 55 0.75,4.45; 56 0.25,4.45; 57 -0.25,4.45; 58 -0.75,4.45; 59 -1.25,4.45; 60 -1.75,4.45; 61 -2.25,4.45; 62 -2.75,4.45; 63 -3.25,4.45; 64 -3.75,4.45 | smd 6 x 6: PAD_GND 0,0
UMAX10 = smd 0.285 x 1.1: 1 -1,-2.25; 2 -0.5,-2.25; 3 0,-2.25; 4 0.5,-2.25; 5 1,-2.25; 6 1,2.25; 7 0.5,2.25; 8 0,2.25; 9 -0.5,2.25; 10 -1,2.25
SOT-23 = smd 0.8 x 0.9: 1 -0.95,-1; 2 0.95,-1; 3 0,1
SOT-23' = smd 1 x 1.4: 1 -0.95,-1.1; 2 0.95,-1.1; 3 0,1.1
SO-8 = smd 1.524 x 0.61: 1 -2.743,1.905; 2 -2.743,0.635; 3 -2.743,-0.635; 4 -2.743,-1.905; 5 2.743,-1.905; 6 2.743,-0.635; 7 2.743,0.635; 8 2.743,1.905
MINI-USB_JACK = smd 2.25 x 0.5: 1 3.52,1.6; 2 3.52,0.8; 3 3.52,0; 4 3.52,-0.8; 5 3.52,-1.6 | smd 2.5 x 2: M1 -2,-4.2; M2 -2,4.2; M3 3.45,4.2; M4 3.45,-4.2 | hole 0.9: 0.9,-2.2; 0.9,2.2
MOLEX_MINIFIT-22 = drill 1.778 pad 2.54 square: P1 -20.955,-2.794; P2 -16.764,-2.794; P3 -12.573,-2.794; P4 -8.382,-2.794; P5 -4.191,-2.794; P6 0,-2.794; P7 4.191,-2.794; P8 8.382,-2.794; P9 12.573,-2.794; P10 16.764,-2.794; P11 20.955,-2.794; P12 20.955,2.794; P13 16.764,2.794; P14 12.573,2.794; P15 8.382,2.794; P16 4.191,2.794; P17 0,2.794; P18 -4.191,2.794; P19 -8.382,2.794; P20 -12.573,2.794; P21 -16.764,2.794; P22 -20.955,2.794 | hole 2.057: -20.955,10.033; 20.955,10.033

### Placement (x,y rotation side)
BLUE_TUNE  0,27.94 270 top
C2  18.92,8 0 top
C3  18.49,17.27 180 top
C4  22.86,7.62 180 top
C5  21.84,10.41 270 top
C6  12.95,13.72 0 top
C7  10.26,16.76 270 top
C8  24.36,15.52 0 top
C9  29.97,24.51 270 top
C10  40.01,13.44 180 top
C11  12.98,19.81 0 top
C12  30.48,7.37 180 top
C13  30.48,9.4 180 top
C14  11.81,10.79 0 top
C15  26.01,11.13 90 top
C16  40.01,16.43 180 top
C17  24.74,18.44 0 top
C18  35.31,9.4 180 top
C19  35.31,7.37 180 top
C20  54.61,7.62 90 top
C21  58.57,21.29 90 top
C22  54,21.29 270 top
C23  48.26,4.83 270 top
C24  50.29,4.83 270 top
C25  69.42,55.17 90 top
C26  76.86,56.18 90 top
C27  52.32,4.83 270 top
C28  54.61,14.99 90 top
C29  58.17,26.92 90 top
C30  54.1,26.92 270 top
C31  58.17,33.53 90 top
C32  54.1,33.53 270 top
C33  48.26,12.19 270 top
C34  50.29,12.19 270 top
C35  52.32,12.19 270 top
C36  24.38,36.83 90 top
C37  36.27,52.63 90 top
C38  27.3,53.85 180 top
C39  46.79,55.4 270 top
C40  31.45,53.29 180 top
C41  57.05,54.15 180 top
C42  25.15,45.97 90 top
C43  58.17,39.88 90 top
C44  54.1,39.88 270 top
C45  18.8,56.64 270 top
C46  24.38,25.65 0 top
C49  42.93,28.19 270 top
D1  11.18,8.13 180 top
D2  49.68,20.27 0 top
D3  49.68,22.81 180 top
D4  51.56,39.88 270 top
D5  49.02,39.88 90 top
D6  16.51,56.64 90 top
D8  49.02,27.18 90 top
D9  51.56,27.18 270 top
D10  49.02,33.53 90 top
D11  51.56,33.53 270 top
D16  51.36,59.92 270 top
D17  40.87,51.44 0 top
D22  65.48,54.13 180 top
IC9  37.24,36.37 180 top
L1  73.05,56.18 270 top
L2  63.96,58.42 0 top
L3  40.94,56.74 270 top
POWER  4.45,5.21 270 top
PS1  22.3,46.28 270 top
Q1  18.67,12.7 270 top
Q4  16.66,21.39 90 top
R1  11.4,28.78 90 top
R2  57.15,6.6 0 top
R3  23.88,10.41 90 top
R4  12.95,21.79 0 top
R5  12.95,15.75 0 top
R6  12.95,17.78 0 top
R7  56.54,21.29 90 top
R8  57.15,8.64 0 top
R9  57.15,13.97 0 top
R10  57.15,16 0 top
R11  8.76,30.23 90 top
R12  32.79,44.5 90 top
R13  53.85,44.42 180 top
R14  56.13,26.92 90 top
R15  46.74,27.18 90 top
R16  32.79,28.24 270 top
R17  56.13,33.53 90 top
R18  46.74,33.53 90 top
R19  35.33,44.5 90 top
R20  35.33,28.24 270 top
R21  37.87,44.5 90 top
R22  37.87,28.24 270 top
R23  40.41,44.5 90 top
R24  40.41,28.24 270 top
R25  53.85,48.01 180 top
R26  27.3,55.88 180 top
R27  28.19,58.67 90 top
R28  26.16,58.67 270 top
R29  8.76,4.57 90 top
R30  8.76,25.63 270 top
R31  70.89,51.87 0 top
R32  22.35,36.83 270 top
R33  56.13,39.88 90 top
R34  46.74,39.88 90 top
R35  44.7,48.01 270 top
R36  51.05,47.12 270 top
R37  22.86,56.64 90 top
R38  20.83,56.64 270 top
RESET  19.05,32 90 top
S1  4.45,30.35 270 top
S2  4.45,24.94 270 top
SV2  32,4.57 0 top
SW1  19.05,32 90 top
SW2  15.24,32 270 top
T1  48.01,48.01 270 top
TEST  15.24,32 270 top
U2  32.21,16.69 90 top
U3  50.55,15.75 90 top
U4  57.91,44.42 90 top
U5  50.55,8.38 90 top
U6  57.91,48.01 90 top
U7  MCP1700  [SOT-23']  21.59,22.61 90 top
U8  33.4,57.18 180 top
X1  3.43,16.26 0 top
X2  66.04,26.29 270 top

### Tracks (layer width: path | path; a pad name or v marks a point on that pad's centre or on a via)
5V_VREF  (via drill 0.36)
  Top 0.61: R31.2 72.31,49.96 v72.26,49.91
  Bottom 0.61: X2.P3 65.28,40.89 70.87,40.89 71.5,41.53 71.5,49.15 v72.26,49.91
5V_VREF_PROTECTED
  Top 0.813: 73.05,54.69 C26.+ | 73.05,54.69 L1.2 | 73.05,54.69 70.94,54.69 70.61,54.36 69.45,54.36 C25.1 | C25.1 69.42,51.92 R31.1 | C25.1 67.57,54.32 D22.C
+5V  (via drill 0.36, 0.5, 0.6, 1)
  Top 0.203: R11.1 v8.76,27.81 R30.1 | IC9.20 42.95,33.25 v42.93,33.27
  Top 0.254: D2.C v49.17,20.27 | D10.C v49.02,33.25 | D8.C v49.02,26.77 | L1.1 72.5,56.78 | 48.3,14.19 U3.10 | 48.8,37.85 D5.C 48.36,37.31 v47.5,37.31
  Top 0.305: v48.26,6.73 48.3,6.77 U5.10 | v48.39,14.1 48.3,14.19 | IC9.20 42.93,31.31 C49.1
  Top 0.406: R27.1 28.84,58.47 v29.34,58.47 | 73.05,59.08 v73.03,59.08 | v14.99,54.61 16.51,54.61 D6.C
  Top 0.61: C27.1 C24.1 C23.1 v48.26,6.73 | C35.1 C34.1 C33.1 48.39,13.17 v48.39,14.1 | PS1.PWR 22.42,45.12 C42.1
  Top 0.813: L1.1 73.05,59.08
  Top 1.016: D1.C v14.86,8.13 | U7.3 21.08,23.2 v21.08,23.88
  Top 1.778: C39.+ 46.79,55.91 v46.86,55.83 45.95,56.74 L3.P$1
  pour Bottom: 0.51,60.55 0.51,2.67 79.76,2.67 79.76,60.55
+12V  (via drill 0.36, 0.9)
  Top 0.61: 52.97,44.4 R13.2 52.96,44.42 v52.96,46.18 | R25.2 52.96,48.01 v52.96,46.18 | v52.96,46.18 52.87,46.27 R36.2
  Top 1.016: L2.2 66.45,57.77
  Top 1.778: v64.26,58.42 L2.2
  Bottom 0.813: X2.P2 60.58,45.72 53.85,45.72 53.39,46.18 v52.96,46.18
  Bottom 1.778: X2.P2 63.37,43.18 64.52,43.18 66.04,44.7 66.04,56.64 v64.26,58.42
ADC0  (via drill 0.36)
  Top 0.203: U2.9 v32.46,13.09 | v15.24,58.42 17.15,58.42 D6.A 17.75,58.54 C45.1 R38.1 R37.2
  Route2 0.203: v32.46,13.09 32.03,13.13 31.32,13.84 24.51,13.84 22.1,11.43 3.05,11.43 1.78,12.7 1.78,44.96 v15.24,58.42
ADC4  (via drill 0.36)
  Top 0.203: U2.3 29.46,11.3 v29.49,11.02 | R14.2 v56.13,29.31 | R15.2 46.71,28.16 v46.71,29.41
  Top 0.254: R14.2 C30.1 52.87,27.77 D9.C D8.A 47.79,29.08 R15.2
  Route2 0.203: v29.49,11.02 29.49,10.39 30.48,9.4 35.56,9.4 37.85,11.68 45.16,11.68 46.2,12.72 46.2,19.48 46.71,19.99 v46.71,29.41
ADC5  (via drill 0.36)
  Top 0.203: U2.4 29.97,12.22 | R17.2 v56.13,35.66 | U2.4 29.97,12.25 | U2.4 29.95,12.25 v29.96,13.09 | R18.2 46.67,34.54 v45.44,34.54
  Top 0.254: R17.2 C32.1 52.61,34.38 D11.C D10.A 48.9,35.41 47.62,35.41 46.74,34.52 R18.2
  Route2 0.203: v45.44,34.54 45.19,34.29 45.19,15.72 v44.96,15.49
  Route15 0.203: 30.01,13.09 v29.96,13.09 29.96,13.2 30.73,13.97 34.04,13.97 35.31,12.7 40.64,12.7 43.43,15.49 v44.96,15.49 44.7,15.49
ADC6  (via drill 0.36)
  Top 0.203: U2.5 | U2.5 30.45,12.45 | C36.1 25.77,35.98 v25.78,35.97 | U2.5 v30.45,11.2
  Top 0.254: C36.1 R32.2
  Route15 0.203: v25.78,35.97 26.8,35.97 28.17,34.59 28.17,23.67 29.21,22.63 29.21,22.1 29.97,21.34 29.97,14.54 29.17,13.74 29.17,12.74 30.45,11.46 v30.45,11.2
ADC7  (via drill 0.36)
  Top 0.203: U2.6 30.96,13.08 v30.96,13.09 | v48.08,40.49 46.98,40.49 R34.2
  Top 0.254: R33.2 C44.1 52.61,40.73 D4.C D5.A 47.79,41.78 R34.2
  Route2 0.203: v48.08,40.49 46.79,39.19 46.79,33.6 45.72,32.54 45.72,12.85 45.03,12.17 32.03,12.17 31.1,13.09 v30.96,13.09
AUX_IN  (via drill 0.36)
  Top 0.254: R14.1 C29.1 59.52,26.18 v59.56,26.14
  Route2 0.305: v59.56,26.14 60.35,26.92 62.61,26.92 X2.P6
CAM_VRS+
  Top 0.254: R9.2 62.99,13.97 X2.P9
CAM_VRS-
  Top 0.254: R10.2 61.34,16 X2.P8
COIL1  (via drill 0.36)
  Top 0.305: R12.2 32.79,46.58 v32.77,46.48
  Route2 0.305: v32.77,46.48 32.77,46.61 33.66,47.5 43.94,47.5 54.74,36.7 71.37,36.7 72.64,35.43 72.64,9.14 X2.P12
COIL2  (via drill 0.36, 0.46)
  Top 0.305: v31.24,27.43 32.75,27.43 R16.2
  Route2 0.305: v31.24,27.43 35.69,27.43 36.58,26.54 36.58,24.51 40.01,21.08 v42.42,21.08 | v60.45,18.67 60.45,19.43 61.09,20.07 64.9,20.07 65.91,19.05 65.91,10.29 66.67,9.53 X2.P13
  Route15 0.305: v42.42,21.08 58.55,21.08 60.45,19.18 v60.45,18.67
COIL3  (via drill 0.36)
  Top 0.305: R19.2 35.31,45.37 v35.31,46.48
  Route15 0.305: v35.31,46.48 35.31,46.99 35.81,47.5 43.94,47.5 54.48,36.96 71.12,36.96 72.64,35.43 72.64,16 70.36,13.72 X2.P14
COIL4  (via drill 0.36)
  Top 0.305: 35.31,27.36 R20.2 35.81,26.91 v35.81,25.78
  Route15 0.305: v35.81,25.78 36.2,25.78 40.01,21.97 58.8,21.97 60.71,20.07 64.9,20.07 67.06,17.91 X2.P15
COIL5  (via drill 0.36, 0.46)
  Top 0.305: R21.2 37.87,46.58 v37.85,46.48
  Route2 0.254: 68.71,22.23 X2.P16
  Route2 0.305: v65.66,31.5 65.66,23.37 66.8,22.23 68.71,22.23
  Route15 0.305: v37.85,46.48 38.86,46.48 39.75,45.59 44.83,45.59 53.72,36.45 57.66,32.51 65.15,32.51 65.66,32 v65.66,31.5
COIL6  (via drill 0.36)
  Top 0.305: v37.85,25.65 37.85,27.36 R22.2
  Route15 0.305: v37.85,25.65 39.24,24.26 66.67,24.26 68.71,26.29 X2.P17
COIL7  (via drill 0.36)
  Top 0.305: R23.2 40.41,46.58 v40.39,46.48
  Route2 0.305: v40.39,46.48 43.94,46.48 53.72,36.45 57.66,32.51 66.8,32.51 X2.P18
COIL8  (via drill 0.36)
  Top 0.305: v40.39,25.65 40.41,25.68 R24.2
  Route15 0.305: X2.P19 67.31,34.67 66.55,33.91 66.55,30.23 64.77,28.45 58.93,28.45 58.29,27.81 42.55,27.81 v40.39,25.65
CRANK_VRS+
  Top 0.254: R2.2 61.98,6.6 X2.P11
CRANK_VRS-
  Top 0.254: R8.2 62.36,8.64 X2.P10
DDM  (via drill 0.36)
  Top 0.203: v15.62,17.78 R6.2 13.8,19.84 C11.2 | v21.77,17.22 22.05,16.94 27.8,16.94
  Top 0.254: 27.8,16.94 U2.56
  Route2 0.203: v15.62,17.78 21.21,17.78 v21.77,17.22
DDP  (via drill 0.36)
  Top 0.203: v15.62,15.75 R5.2 C6.2 | v21.77,16.18 22.03,16.44 U2.57
  Route2 0.203: v15.62,15.75 21.34,15.75 v21.77,16.18
GND
  Top 0.203: 28.68,14.94 U2.60 | 28.68,14.94 28.83,14.94 | 29.46,21.6 U2.46 | 29.46,21.6 29.21,21.84 29.21,21.87 28.93,22.15 | 29.46,21.6 29.46,21.59 29.46,17.88 29.72,17.63 29.54,17.45 28.63,17.45 28.61,17.44 U2.55 27.74,17.42 26.34,17.42 | U2.17 36.61,12.95 36.6,12.95 35.84,12.95 35.36,13.23 35.32,13.27 35.31,13.27 35.33,13.25 | U2.60 26.7,14.94 26.11,14.78 26.01,14.68 | U2.60 27.84,14.94 | 28.6,11.35 28.96,11.71 U2.2 | U2.2 | U2.2 28.93,12.27 | U2.2 28.98,12.22 | U2.2 | 35.33,13.25 35.34,13.23 35.33,13.23 35.33,13.25 | 35.33,13.25 34.63,13.25 34.62,13.26 34.62,14.13 34.65,14.11 34.65,14.08 | U5.6 48.31,9.4 50.04,9.4 | U5.9 49.78,7.87 | U3.6 48.31,16.76 49.91,16.76 | U3.9 49.66,15.24 | 51.69,9.37 53.72,9.37 | 52.83,8.89 51.74,8.89 | 51.69,16.76 53.82,16.76 | 51.77,16.26 52.78,16.26 52.81,16.28 | 28.95,14.72 28.89,14.72 28.68,14.94 | U2.2 28.96,13.06
  Top 0.254: U2.PAD_GND 31.99,14.73 28.95,14.72 28.96,14.73
  pour Top: 0.51,60.55 0.51,2.67 79.63,2.67 79.63,60.55
GPI0  (via drill 0.36)
  Top 0.203: D2.A 51.58,18.71 v51.55,18.68 | U2.26 36.63,17.46 | U2.26 36.65,17.45 | U2.26 v35.8,17.44
  Top 0.254: D2.A D3.C
  Route15 0.203: v51.55,18.68 51.54,18.67 46.99,18.67 45.59,17.27 37.59,17.27 37.43,17.44 v35.8,17.44
GPO0  (via drill 0.36)
  Top 0.203: IC9.11 31.52,33.25 v31.5,33.27 | v39.24,19.18 39.5,19.18 39.37,19.05 37.97,19.05 37.59,19.43 U2.30
  Route15 0.203: v31.5,33.27 31.5,29.84 34.04,27.3 34.04,24.64 34.92,23.75 35.94,23.75 39.62,20.07 39.62,19.56 v39.24,19.18
GPO1  (via drill 0.36)
  Top 0.203: IC9.8 34.06,39.78 v34.04,39.62 | v35.8,18.94 36.64,18.92 U2.29
  Bottom 0.203: v34.04,39.62 34.04,34.67 34.92,33.78 34.92,25.27 36.58,23.62 36.58,22.73 35.69,21.84 35.69,19.05 v35.8,18.94
GPO2  (via drill 0.36)
  Top 0.203: IC9.13 34.06,33.25 v34.04,33.27 | v40.13,18.54 39.65,18.44 U2.28
  Route15 0.203: v40.13,18.54 40.13,20.19 36.07,24.26 35.05,24.26 34.54,24.77 34.54,29.34 34.04,29.84 v34.04,33.27
GPO3  (via drill 0.36)
  Top 0.203: IC9.6 36.6,39.78 v36.58,39.62 | v41.02,18.03 40.89,18.03 40.64,17.78 39.62,17.78 39.5,17.91 36.69,17.91 U2.27
  Route15 0.203: v41.02,18.03 40.89,18.16 40.89,20.07 36.2,24.77 35.31,24.77 35.05,25.02 35.05,27.69 35.03,27.71 35.03,36.52 36.58,38.08 v36.58,39.62
GPO4  (via drill 0.36)
  Top 0.203: IC9.15 36.6,33.22 v36.58,33.27 | v38.2,15.44 38.27,15.44 U2.22
  Bottom 0.203: v36.58,33.27 36.58,29.31 39.01,26.87 39.01,23.01 42.34,19.68 42.34,17.91 41.4,16.97 39.73,16.97 v38.2,15.44
GPO5  (via drill 0.36)
  Top 0.203: IC9.4 39.14,39.65 v39.12,39.62 | v33.45,13.09 33.46,13.13 U2.11
  Bottom 0.203: v39.12,39.62 39.12,36.2 37.39,34.47 36.42,34.47 35.59,33.63 35.59,28.73 36.96,27.36 36.96,24.36 37.59,23.72 37.59,21.46 37.19,21.06 37.19,19.28 36.12,18.21 35.18,18.21 33.53,16.56 33.53,13.34 v33.45,13.09
GPO6  (via drill 0.36)
  Top 0.203: IC9.17 39.14,33.23 v39.22,33.27 | U2.14 34.98,12.22 34.98,10.92 35.66,10.24 37.59,10.24 v37.85,9.98
  Route2 0.203: v39.22,33.27 37.44,35.05 28.63,35.05 26.36,32.79 v26.36,30.86
  Route15 0.203: v26.36,30.86 26.36,22.91 27.91,21.36 27.91,15.09 26.06,13.23 26.06,9.68 27.99,7.75 35.61,7.75 v37.85,9.98
GPO7  (via drill 0.36)
  Top 0.203: IC9.2 41.68,39.52 v41.71,39.62 | U2.41 31.96,21.86 31.83,22 31.83,22.53 31.39,22.96 31.39,24.79 v31.77,25.17
  Route15 0.203: v41.71,39.62 39.57,41.63 31.75,41.63 29.84,39.73 29.84,27.1 v31.77,25.17
GPO8  (via drill 0.36)
  Top 0.203: U2.42 31.46,21.81 v31.06,22.28 | v43.31,48.77 43.4,48.86 R35.1
  Route15 0.203: v31.06,22.28 28.7,24.64 28.7,45.97 31.5,48.77 v43.31,48.77
GPO9  (via drill 0.36)
  Top 0.203: v57.91,46.99 58.85,46.99 U6.1 | v35.66,11.23 35.64,11.35 35.94,11.63 35.94,12.22 U2.16
  Route15 0.203: v35.66,11.23 36.12,11.23 37.08,12.19 42.16,12.19 v43.94,13.97
  Bottom 0.203: v57.91,46.99 47.5,46.99 43.94,43.43 v43.94,13.97
GPO10  (via drill 0.36)
  Top 0.203: IC9.1 42.95,39.65 v42.93,39.62 | 34.47,21.13 U2.36 v34.45,20.28 | IC9.19 41.68,33.25 v41.66,33.27
  Route2 0.203: v34.45,20.28 36.58,22.43 36.58,23.75 33.78,26.54 30.99,26.54 30.23,27.3 30.23,33.78 30.73,34.29 36.83,34.29 38.86,32.26 40.13,32.26 41.15,33.27 v41.66,33.27
  Route15 0.203: v42.93,39.62 42.93,38.61 41.66,37.34 v41.66,33.27
GPO11  (via drill 0.36)
  Top 0.203: v57.02,42.6 57.9,43.48 U4.1 | v35.8,14.94 35.82,14.94 U2.21
  Route2 0.203: v44.98,42.77 44.81,42.77 44.37,42.34 44.37,18.77 42.77,17.17 37.08,17.17 35.8,15.89 v35.8,14.94
  Bottom 0.203: v44.98,42.77 45.16,42.6 v57.02,42.6
N$1  (via drill 0.36)
  Top 0.203: TEST.2 SW2.P$2 15.13,27.94 v13.84,27.94 | v32.26,23.14 32.26,22.15 32.46,21.95 U2.40
  Top 0.305: R1.1 11.42,27.94 v13.84,27.94
  Route2 0.203: v32.26,23.14 30.45,23.14 28.45,25.15 26.42,25.15 25.4,26.16 21.59,26.16 20.07,27.69 14.1,27.69 v13.84,27.94
N$2
  Top 0.203: R2.1 56.13,6.77 C20.1 54,7.38 U5.1
N$3  (via drill 0.36)
  Top 0.203: 11.94,15.91 12.06,15.79 12.06,15.75 | R4.1 12.05,21.84 v11.05,21.84
  Top 0.254: X1.3 8.94,16.26 9.4,15.8 10.2,15.8 C7.2 v11.18,15.91 11.94,15.91 R5.1
  Route15 0.203: v11.05,21.84 11.18,21.72 v11.18,15.91
N$4
  Top 0.254: X1.2 8.93,17.06 9.4,17.53 9.95,17.53 C7.1 11.94,17.61 R6.1
N$5
  Top 0.203: R9.1 56.13,14.14 C28.1 54,14.75 U3.1
N$6
  Top 0.203: R10.1 56.13,15.84 C28.2 54.02,15.25 U3.2
N$7
  Top 0.254: PS1.OUT 22.35,39.88 R32.1
N$8
  Top 0.406: U8.5 30.21,59.52 R27.2 R28.1
N$9
  Top 0.61: C37.2 36.27,55.14 U8.1
N$10
  Top 0.254: 38.82,57.51 39.09,57.24 L3.P$2
  Top 0.61: C37.1 38.48,51.78 D17.C
  Top 1.016: U8.3 39.12,57.81 39.32,57.81 39.47,57.66
  Top 1.778: D17.C 38.82,57.51 39.12,57.81
N$11
  Top 0.406: C38.2 R26.2
N$12
  Top 0.406: 30.1,57.78 28.19,55.88 R26.1
  Top 0.61: U8.6 30.63,57.78 30.1,57.78
N$13
  Top 0.61: C40.2 30.59,55.21 U8.8
N$14
  Top 0.203: R8.1 56.13,8.47 C20.2 54.02,7.88 U5.2
N$15
  Top 0.813: 52.58,59.18 51.74,59.18 D16.P$1
  Top 1.27: L2.1 61.66,58.99 61.47,59.18 52.58,59.18
N$16
  Top 0.254: T1.B 46.81,47.16 R35.2
N$18
  Top 0.203: Q4.3 15.41,21.79 R4.2
N$19
  Top 0.203: S1.A 8.22,31.62 R11.2
N$21
  Top 0.203: S2.A 7.25,26.21 R30.2
N$22
  Top 0.254: POWER.C 6.31,3.72 R29.1
  Top 0.305: POWER.C 6.13,4.23
N$26
  Top 0.305: IC9.9 R12.1
N$27
  Top 0.305: R16.1 IC9.12
N$28
  Top 0.305: IC9.7 R19.1
N$29
  Top 0.305: R20.1 IC9.14
N$30
  Top 0.305: IC9.5 R21.1
N$31
  Top 0.305: R22.1 IC9.16
N$32
  Top 0.305: IC9.3 R23.1
N$33
  Top 0.305: R24.1 IC9.18
N$40
  Top 0.203: C4.1 23.71,9.4 R3.1
OPTION_IN  (via drill 0.36)
  Top 0.254: R7.1 C21.1
  Top 0.305: C21.1 58.57,18.95 v58.55,18.92
  Route2 0.305: v58.55,18.92 58.55,19.81 60.83,22.1 X2.P7
PGM_OUT  (via drill 0.36)
  Top 0.61: U4.3 v55.88,44.42 R13.1
  Route15 0.61: X2.P21 66.8,41.02 60.45,41.02 57.05,44.42 v55.88,44.42
PLLRC
  Top 0.203: 27.23,13.41 27.1,13.28 26.7,13.28 26.36,12.95 24.38,12.95 23.88,12.45 R3.2
  Top 0.254: C5.1 R3.2 | 27.23,13.41 27.3,13.44 U2.63
PROC_PULSE_IN
  Top 0.254: C22.1 R7.2
PROC_STATUS_LED_OUT1  (via drill 0.36)
  Top 0.203: U2.37 33.96,21.74 34.24,22.02 34.24,22.84 33.98,23.09 v33.98,23.39 33.96,23.24
  Route2 0.203: S1.C 11.56,29.08 13.46,30.99 19.56,30.99 22.1,28.45 28.45,28.45 30.99,25.91 33.53,25.91 34.04,25.4 34.04,23.44 v33.98,23.39
PROC_STATUS_LED_OUT2  (via drill 0.36)
  Top 0.203: v33.02,24.38 33.02,23.37 33.71,22.68 33.71,22.1 33.48,21.87 33.48,21.16 U2.38
  Route2 0.203: S2.C 7.42,23.67 14.22,30.48 19.3,30.48 21.84,27.94 27.48,27.94 31.04,24.38 v33.02,24.38
RESET  (via drill 0.36)
  Top 0.203: RESET.1 v19.05,29.72 SW1.P$1 | v32.94,22.45 32.96,22.04 U2.39
  Route2 0.203: v32.94,22.45 32.94,23.44 32.51,23.88 30.73,23.88 28.96,25.65 26.92,25.65 25.91,26.67 22.1,26.67 v19.05,29.72
  Route15 0.203: SV2.2 25.65,6.22 17.02,14.86 17.02,18.16 15.24,19.94 15.24,25.15 | 15.24,25.15 15.24,27.81 17.14,29.72 v19.05,29.72 | 15.24,25.15 BLUE_TUNE.P3A
RXD0  (via drill 0.36)
  Top 0.203: v34.92,22.1 34.96,22.26 U2.35
  Route2 0.203: v34.92,22.1 29.59,16.76 25.65,16.76 19.05,23.37 BLUE_TUNE.P1A
SAFE12V  (via drill 0.46, 0.6, 0.9)
  Top 0.203: R37.1 v22.86,54.61
  Top 0.61: 50.65,56.2 D16.P$3
  Top 1.016: U8.2 34.59,56.54 v34.54,56.59 | v50.65,57.43 50.65,56.2 | C41.+ 51.38,54.15 50.67,54.86 50.67,56.07 D16.P$3
  Route2 0.203: v22.86,54.61 24.84,56.59 v34.54,56.59
  Bottom 1.676: v50.65,57.43 49.78,58.29 36.25,58.29 v34.54,56.59
SHIFT_LIGHT  (via drill 0.36)
  Top 0.61: R25.1 v55.83,48.01 U6.3
  Route2 0.61: X2.P20 66.8,40.89 61.34,40.89 55.83,46.41 v55.83,48.01
TACH_OUT  (via drill 0.36)
  Top 0.61: v51.05,49.78 R36.1 51.02,48.01 T1.C
  Route2 0.61: X2.P22 66.29,49.78 v51.05,49.78
TCK  (via drill 0.36)
  Top 0.203: U2.53 28.6,18.44 v28.61,18.44
  Route2 0.203: v28.07,8.89 28.07,8.51 28.57,8 29.08,7.49 32.13,7.49 33.27,6.35 SV2.5
  Route15 0.203: v28.61,18.44 28.6,14.88 28.6,14.76 28.19,14.35 28.19,9.02 v28.07,8.89
TDI  (via drill 0.36)
  Top 0.203: U2.33 35.96,21.35 36.32,21.72 v36.85,21.72
  Route2 0.203: v36.85,21.72 38.35,21.72 40.01,20.07 42.8,20.07 v43.18,19.68
  Route15 0.203: v43.18,19.68 43.31,19.56 52.2,19.56 52.96,18.8 52.96,13.08 46.86,6.99 42.55,2.67 32.77,2.67 32,3.43 32,5.84 31.37,6.48 29.46,6.48 28.19,5.21
  Route15 0.254: SV2.3 28.19,5.21
TDO  (via drill 0.36)
  Top 0.203: U2.49 27.63,20.63 v27.05,21.08
  Route15 0.203: v27.05,21.08 27.05,20.27 27.48,19.84 27.48,15.34 25.53,13.39 25.53,9.4 27.81,7.11 33.91,7.11 35.81,5.21 SV2.6
TEMP_IN  (via drill 0.36)
  Top 0.254: R33.1 C43.1 59.65,39.03 v59.69,38.99
  Bottom 0.254: X2.P4 59.69,38.23 v59.69,38.99
TIMER0  (via drill 0.36, 0.5)
  Top 0.203: U2.48 28.45,21.15 28.45,21.97 v27.81,22.61 | v46.86,8.89 48.29,8.89 U5.7
  Route15 0.203: v46.86,8.89 44.48,11.28 37.29,11.28 34.77,8.76 29.69,8.76 28.7,9.75 28.7,14.1 29.46,14.86 29.46,20.95 v27.81,22.61
TIMER1  (via drill 0.36, 0.5)
  Top 0.203: U3.7 47.25,16.24 v46.97,16.26 | v39.29,15.16 39.06,15.16 38.35,14.45 36.67,14.45 U2.20
  Route15 0.203: v39.29,15.16 40.39,16.26 v46.97,16.26
TMS  (via drill 0.36)
  Top 0.203: U2.51 27.18,19.44 v26.77,19.07
  Route15 0.203: v26.77,19.07 25.65,19.05 25.02,18.41 25.02,8.89 26.98,6.93 26.98,3 27.48,2.49 30.12,2.49 30.68,3.05 30.68,4.52 SV2.4
TPS_IN  (via drill 0.36)
  Top 0.254: R17.1 C31.1 v58.17,31.47
  Route2 0.305: X2.P5 59.16,30.48 v58.17,31.47
TXD0  (via drill 0.36)
  Top 0.203: v35.69,22.86 35.81,22.61 35.81,21.97 35.43,21.59 35.43,21.16 U2.34
  Route2 0.203: v35.69,22.86 34.67,22.86 29.08,17.27 26.16,17.27 20.07,23.37 20.07,26.42 19.3,27.18 17.27,27.18 16.51,26.42 BLUE_TUNE.P2A 16.51,26.16
USB_PULLUP  (via drill 0.36, 0.46)
  Top 0.203: Q4.1 17.52,20.19 v16.38,20.19 | v35.8,13.93 35.85,13.94 U2.19
  Route2 0.203: v16.38,20.19 19.81,20.19 25.65,14.35 33.53,14.35 33.95,13.93 v35.8,13.93
V+  (via drill 0.36, 0.46, 0.6)
  Top 0.203: 36.61,13.44 v37.67,13.44 C10.2 | U2.58 U2.59 27.79,15.42 | U2.45 29.97,21.1 v29.97,22.35 | v31.32,10.52 31.32,11.38 31.33,11.47 31.33,11.6 31.32,11.61 31.45,11.73 31.45,12.25 31.46,12.26 U2.7 | U2.1 28.46,11.97 v27.41,10.92 | TEST.1 15.11,32.77 | Q4.2 17.49,22.61 v16.26,22.61
  Top 0.254: U2.45 29.97,21.09 v29.97,22.35 C9.2 | 36.61,13.44 U2.18 | U2.59 27.11,15.44 26.72,15.57
  Top 0.305: TEST.1 v15.24,34.29 SW2.P$1
  Top 0.406: 25.69,15.44 v26.34,15.57 26.72,15.57 | 31.33,11.47 C13.1
  Top 0.61: C13.1 C12.1 | 25.69,15.44 C8.2
  Top 1.016: C46.+ 22.69,25.46 U7.2 22.76,23.62 v24.26,23.62
  Route2 0.203: v24.26,29.84 24.26,32.13 22.1,34.29 v15.24,34.29
  Route15 0.203: v16.26,22.61 22.61,22.61 23.62,23.62 v24.26,23.62
  Bottom 1.016: 37.67,13.01 v37.67,13.44 37.67,11.48 36.12,9.93 31.77,9.93 v31.32,10.52 30.99,9.93 28.4,9.93 v27.41,10.92 | v29.97,22.35 28.19,24.13 24.38,24.13 24.38,23.88 v24.26,23.62 | v24.26,23.62 v24.26,29.84 | v27.41,10.92 26.21,10.92 25.88,11.25 25.88,15.21 v26.34,15.57 24.26,17.63 v24.26,23.62 | SV2.1 23.11,8.76 25.27,10.92 v27.41,10.92
VBUS  (via drill 0.6)
  Top 0.61: X1.1 8.33,17.86 8.76,18.29 v8.89,18.29
  Top 1.016: D1.A 8.74,8.13 | D1.A 10.31,9.31 C14.+ | v7.35,8.51 7.98,7.87 D1.A
  Bottom 0.61: v8.89,18.29 8.89,18.02
  Bottom 1.016: v7.35,8.51 7.35,16.87 8.76,18.29 v8.89,18.29
VDDOUT  (via drill 0.36)
  Top 0.203: 27.58,17.93 27.69,17.94 | U2.8 31.98,12.27 31.95,11.76 32.13,11.58 v32.13,11.28 | U2.24 36.61,16.43 37.26,16.43 | 27.1,12.62 v27,12.45 | U2.64 27.8,12.93 27.46,12.93 v27,12.45 | v27,12.45 27.13,12.57 | 27.58,17.93 U2.54 | C18.2 34.53,9.22 34.56,9.22 | 27.58,17.93 26.95,17.93 v26.77,18.11
  Top 0.254: 33.96,11.66 33.96,12.29 U2.12 | U2.64 27.44,12.94 27.19,12.69 | 27.19,12.69 27.03,12.52 26.2,12.52 C15.2 | U2.54 | C17.2 26.24,18.44 26.54,18.14 v26.77,18.11 | 27.1,12.62 27.16,12.69 27.19,12.69
  Top 0.406: 33.96,11.66 v34.21,11.25 34.21,9.5 | v37.77,16.43 37.26,16.43
  Top 0.61: 34.21,9.5 34.19,9.47 34.56,9.22 | C18.2 C19.2 | v37.77,16.43 C16.2
  Bottom 0.61: v26.77,18.11 26.77,17.58 27.43,16.92 27.43,14.88 27,14.45 v27,12.45 27.36,12.09 31.32,12.09 v32.13,11.28 32.13,11.25 v34.21,11.25 34.44,11.48 34.44,15.39 35.43,16.38 37.72,16.38 v37.77,16.43
XIN1
  Top 0.203: 27.8,14.43 26.62,14.43 26.06,13.87 21.79,13.87 20.75,12.83 18.54,12.83 17.62,13.75 | 17.57,13.88 Q1.1 17.64,14.62 C3.2
  Top 0.254: 27.8,14.43 U2.61 | 17.57,13.88 17.62,13.88 17.62,13.75
XOUT1
  Top 0.203: 27.79,13.95 26.75,13.95 26.21,13.41 21.95,13.41 19.77,11.23 Q1.3 | Q1.3 19.77,11.13 | C2.2 19.77,7.88 Q1.3
  Top 0.254: 27.79,13.95 U2.62

### Text on the board
tPlace: www.autosportlabs.net | Megajolt/C | Rev B | Copyright 2010-2012 Autosport Labs - All Rights Reserved